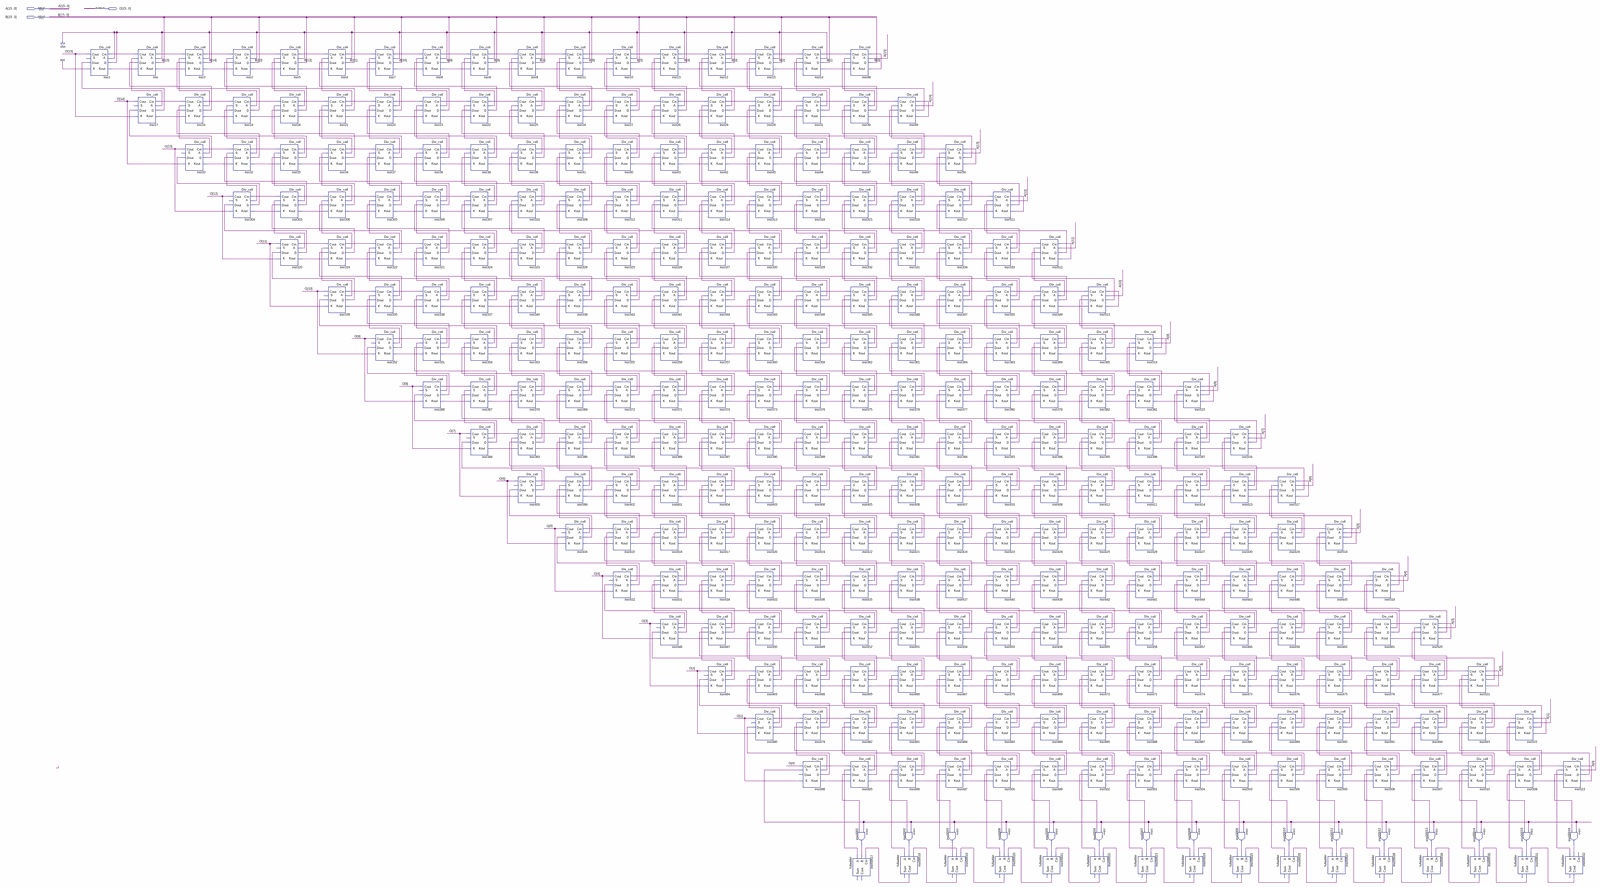
[diagram p0: schematic sheet, whole]
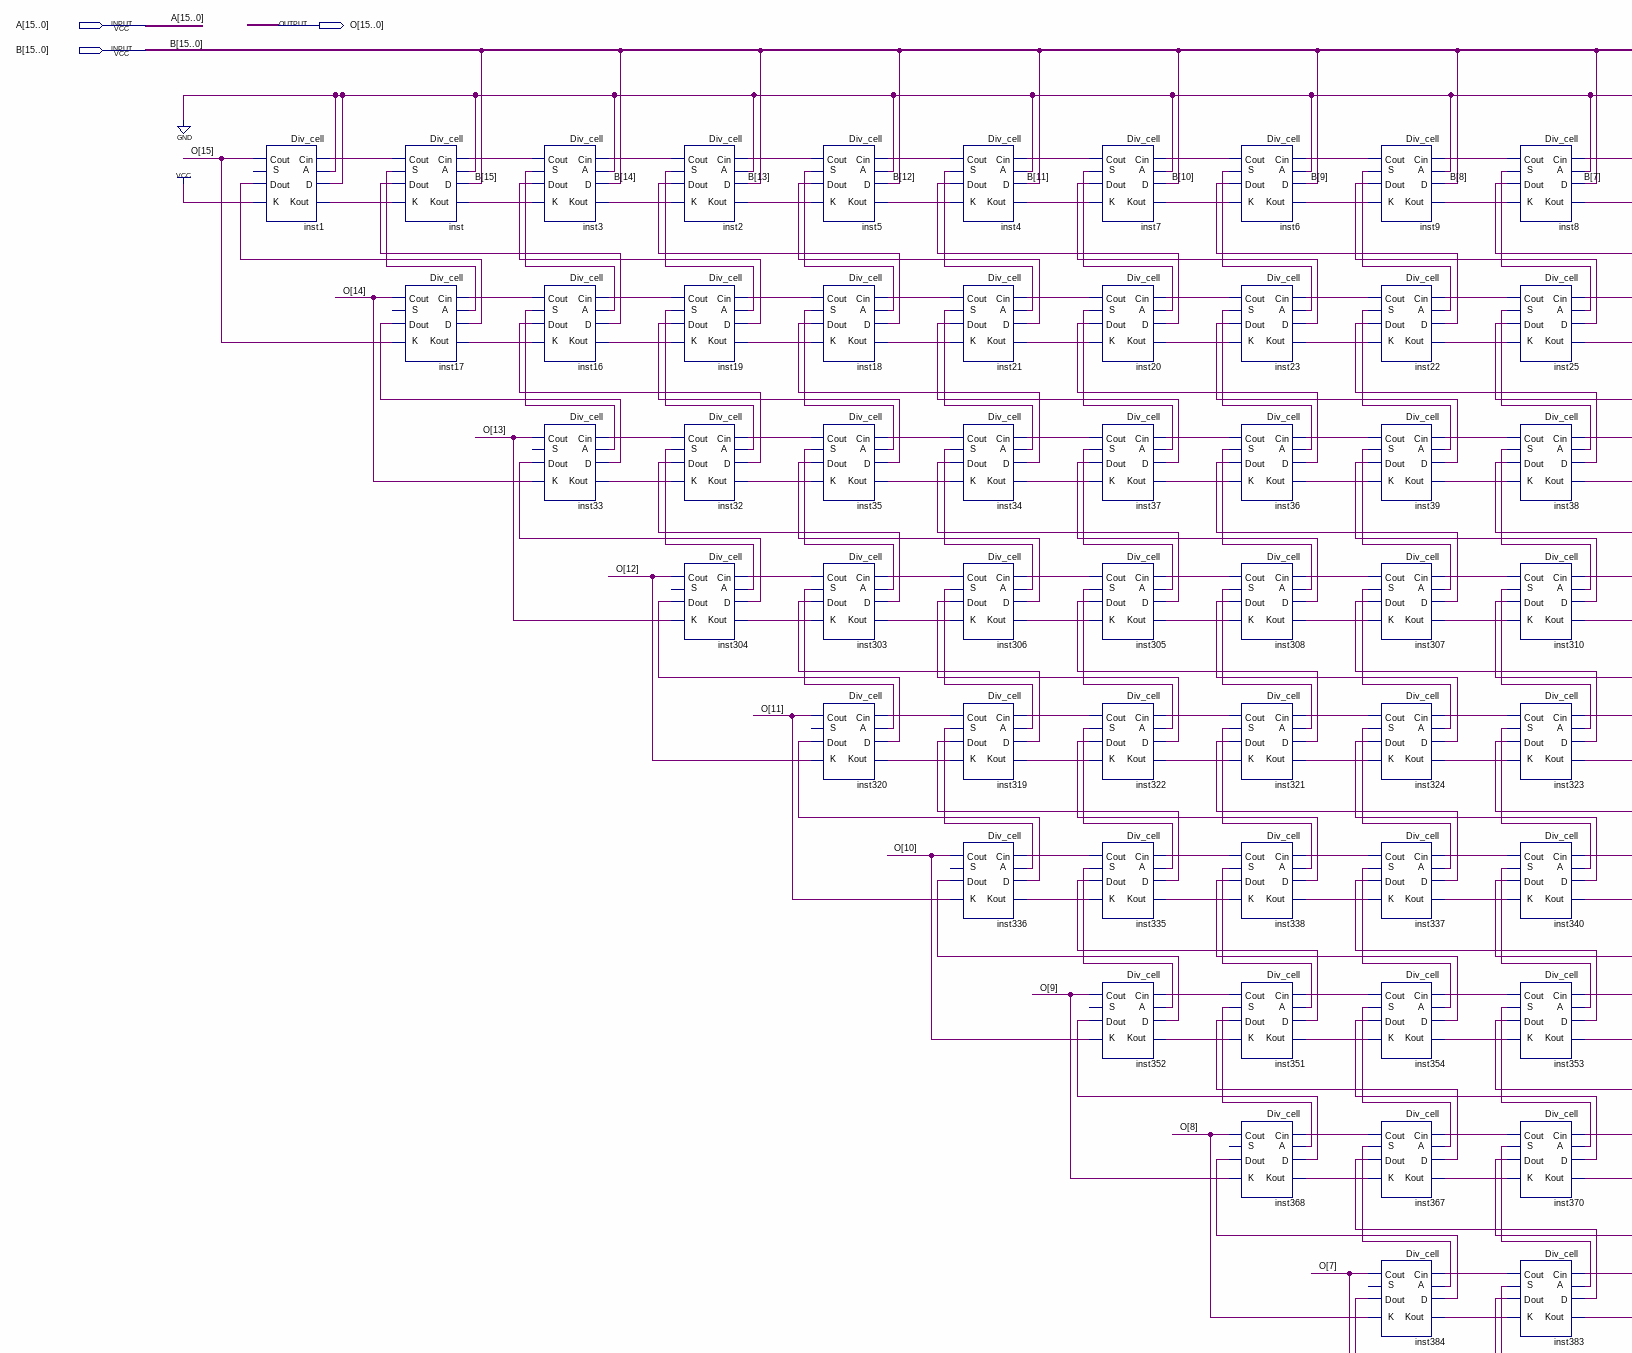
[diagram p1: schematic sheet, upper left part]
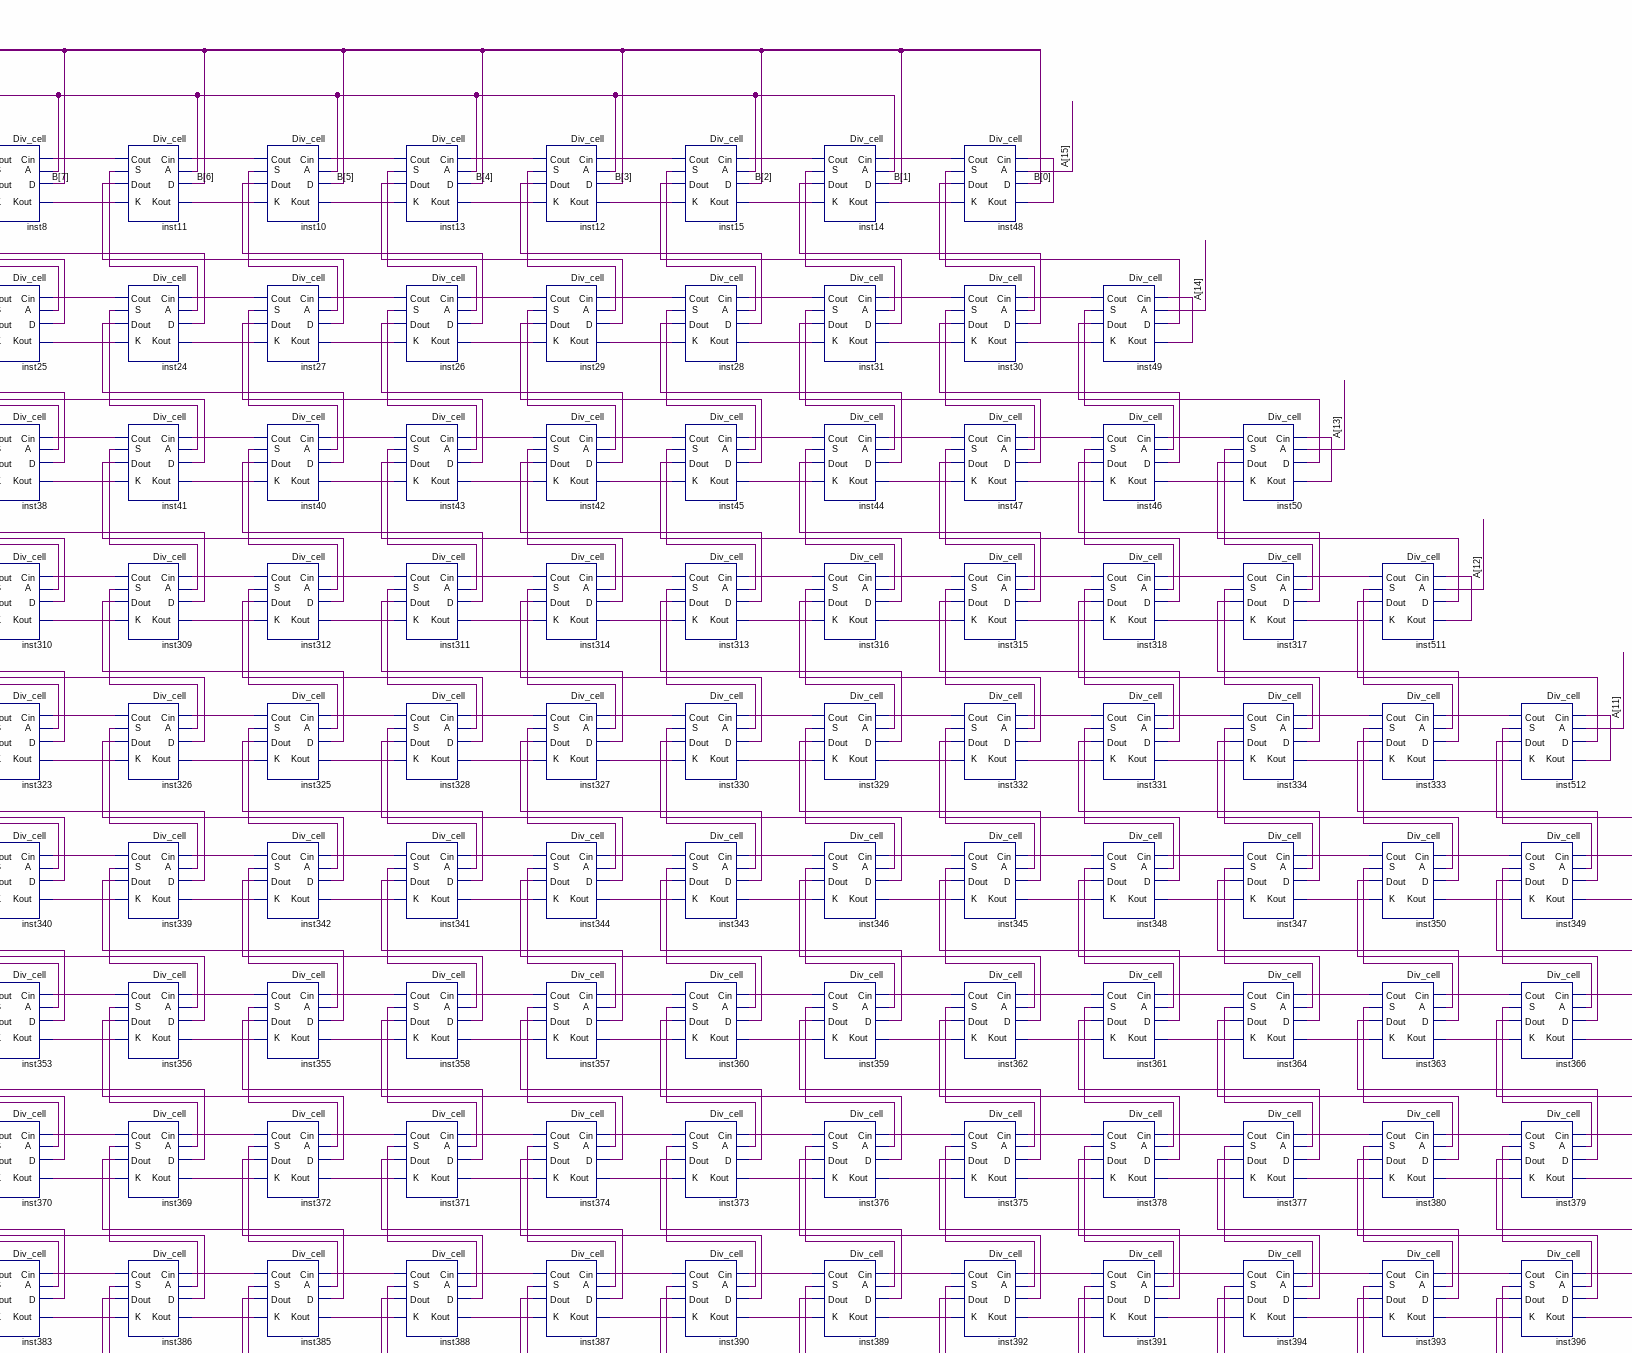
[diagram p2: schematic sheet, upper centre part]
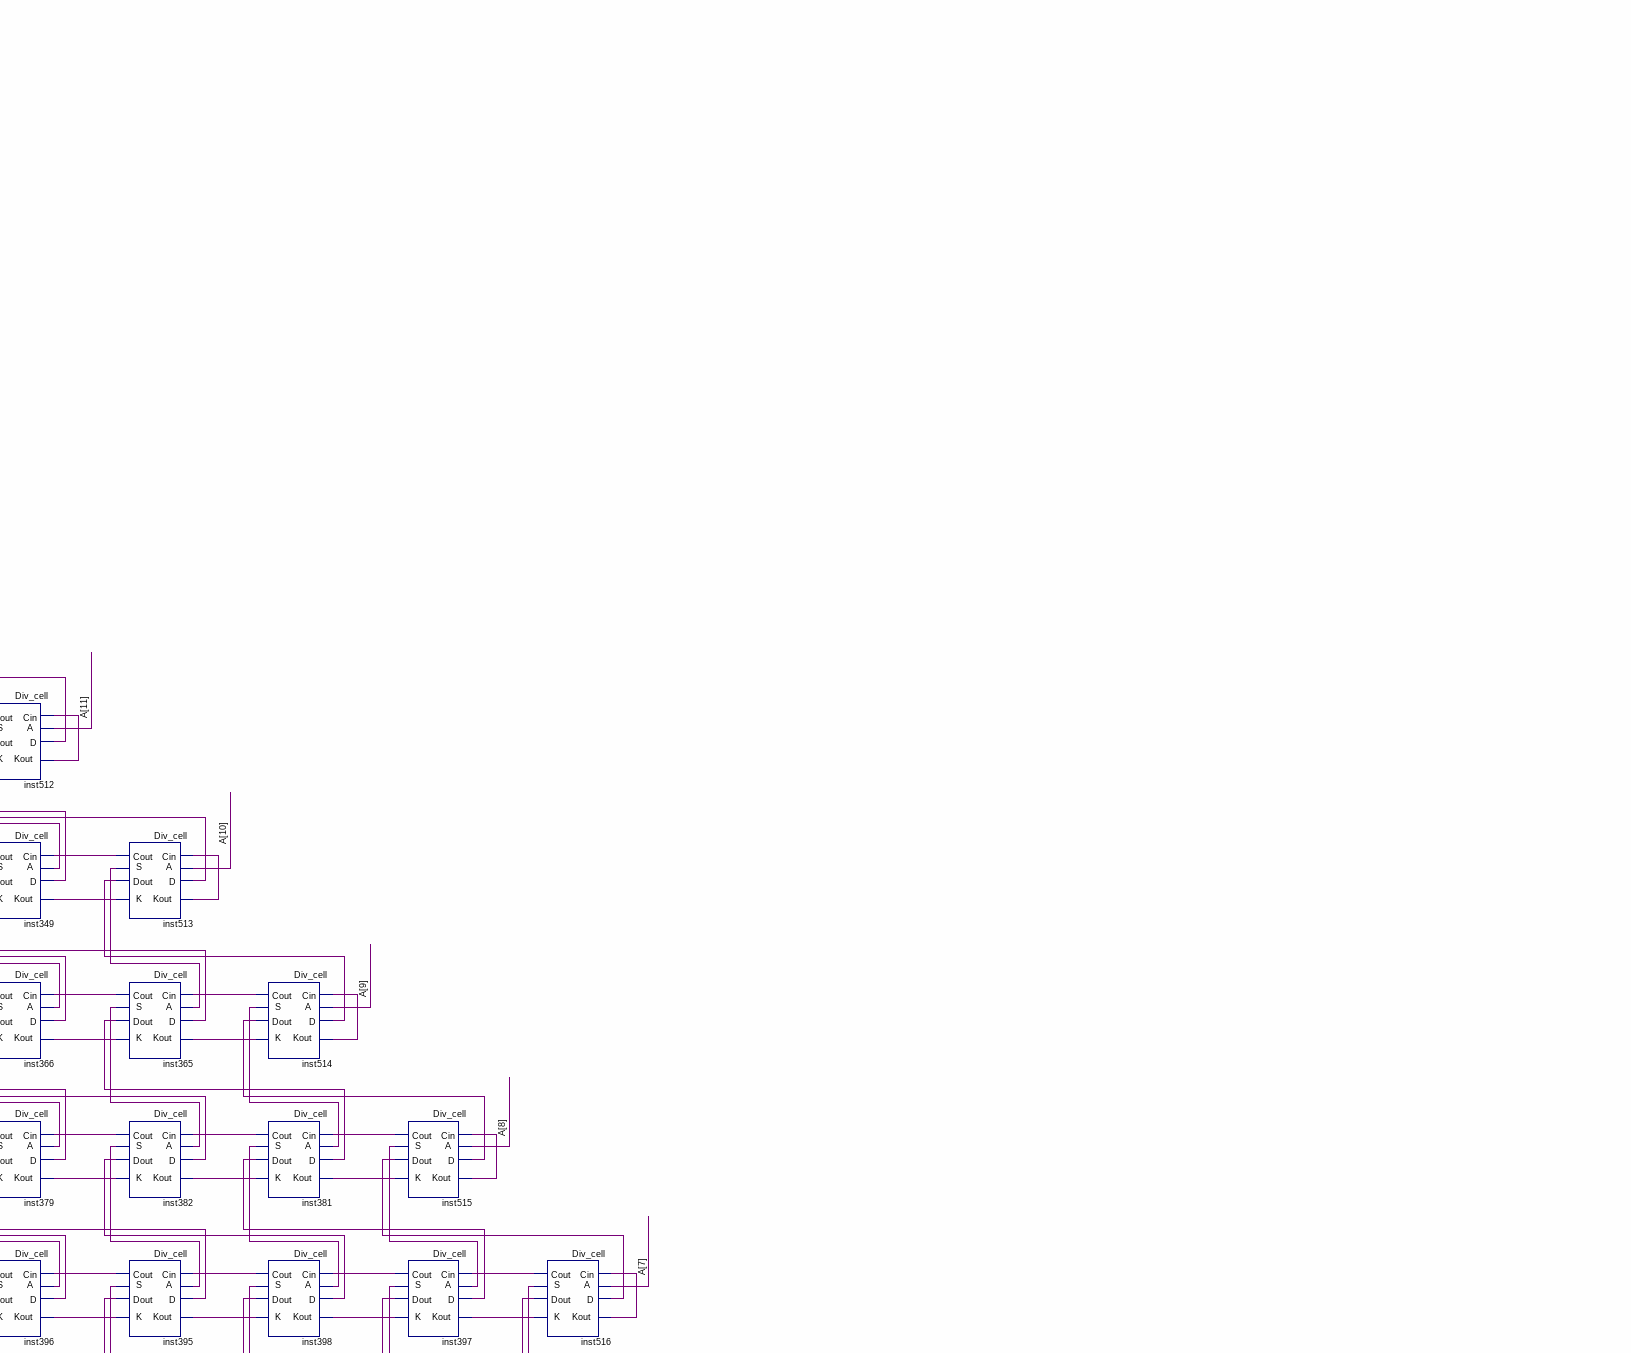
[diagram p3: schematic sheet, upper right part]
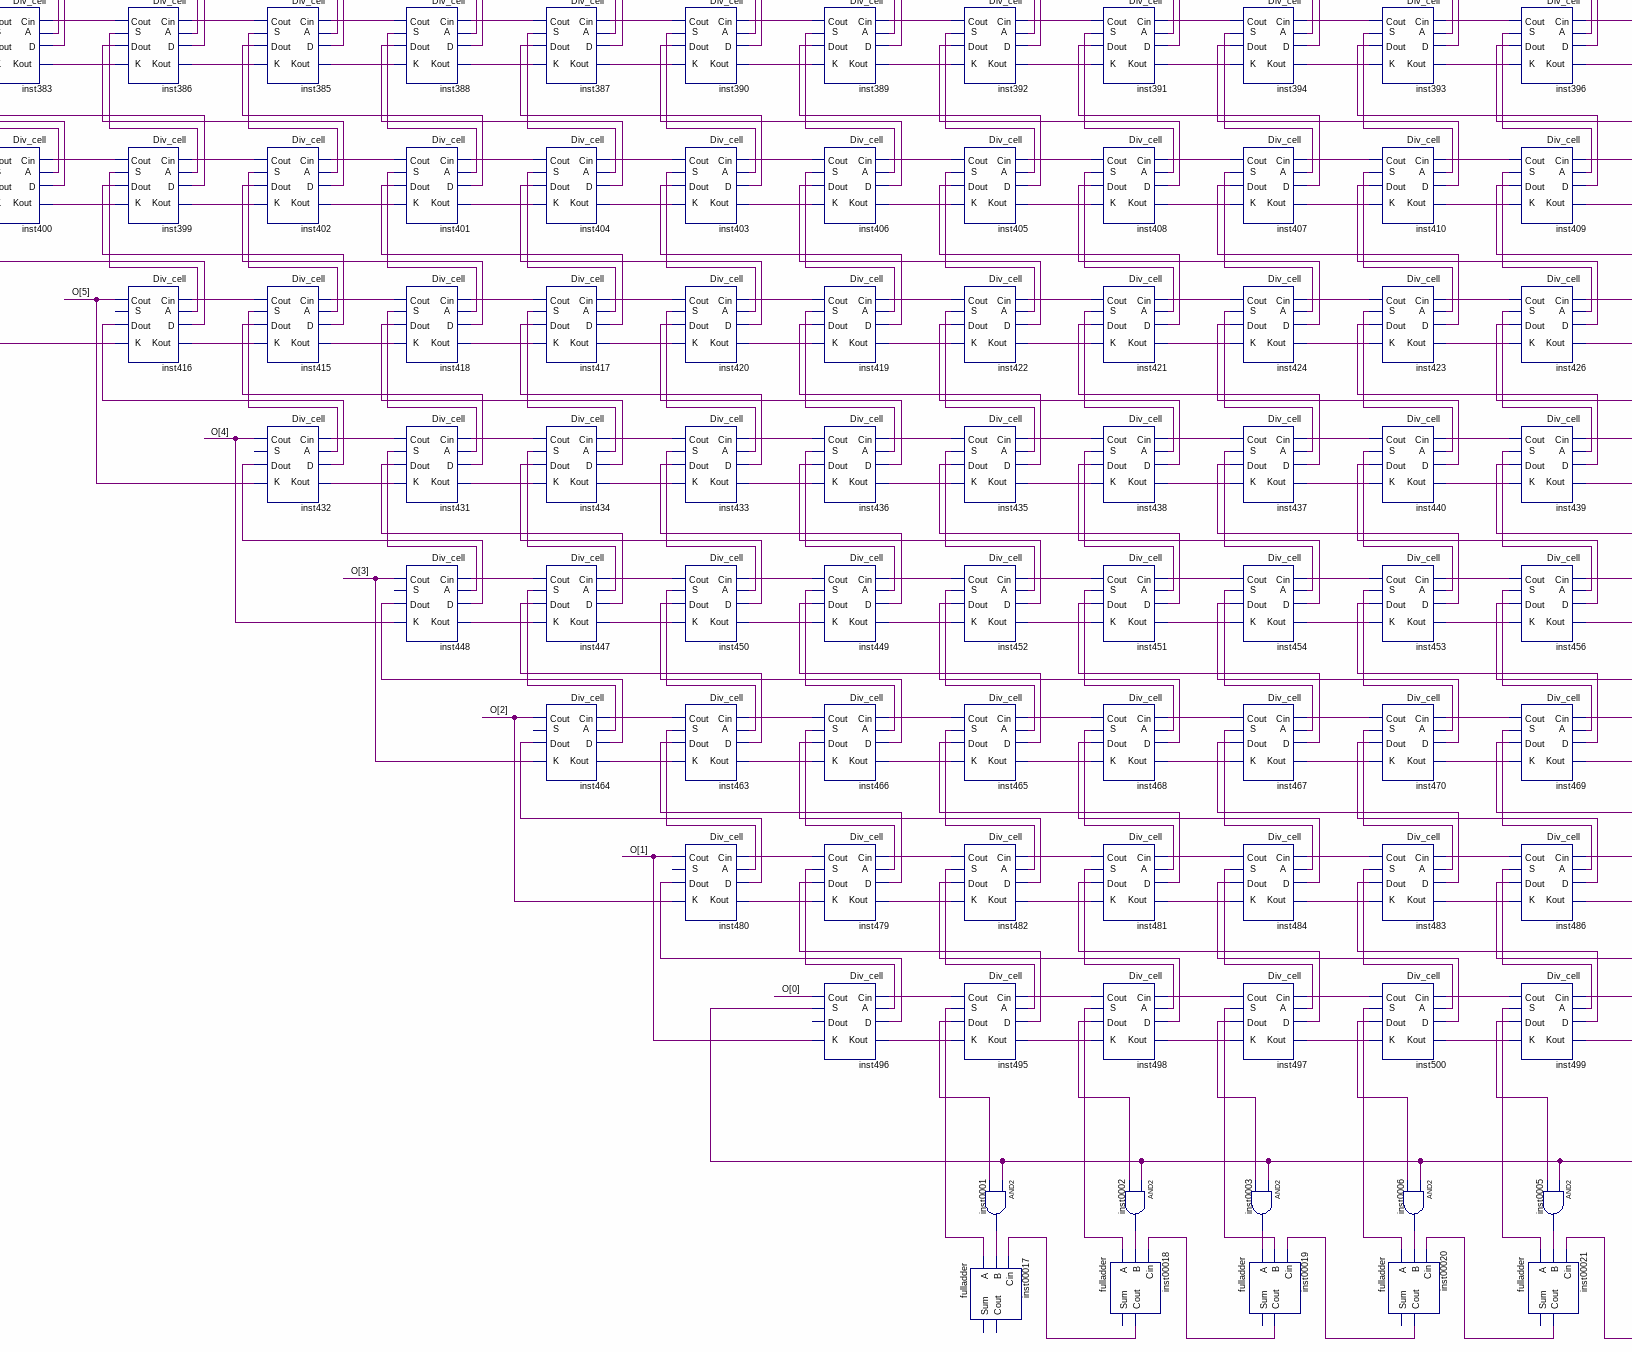
[diagram p4: schematic sheet, lower centre part]
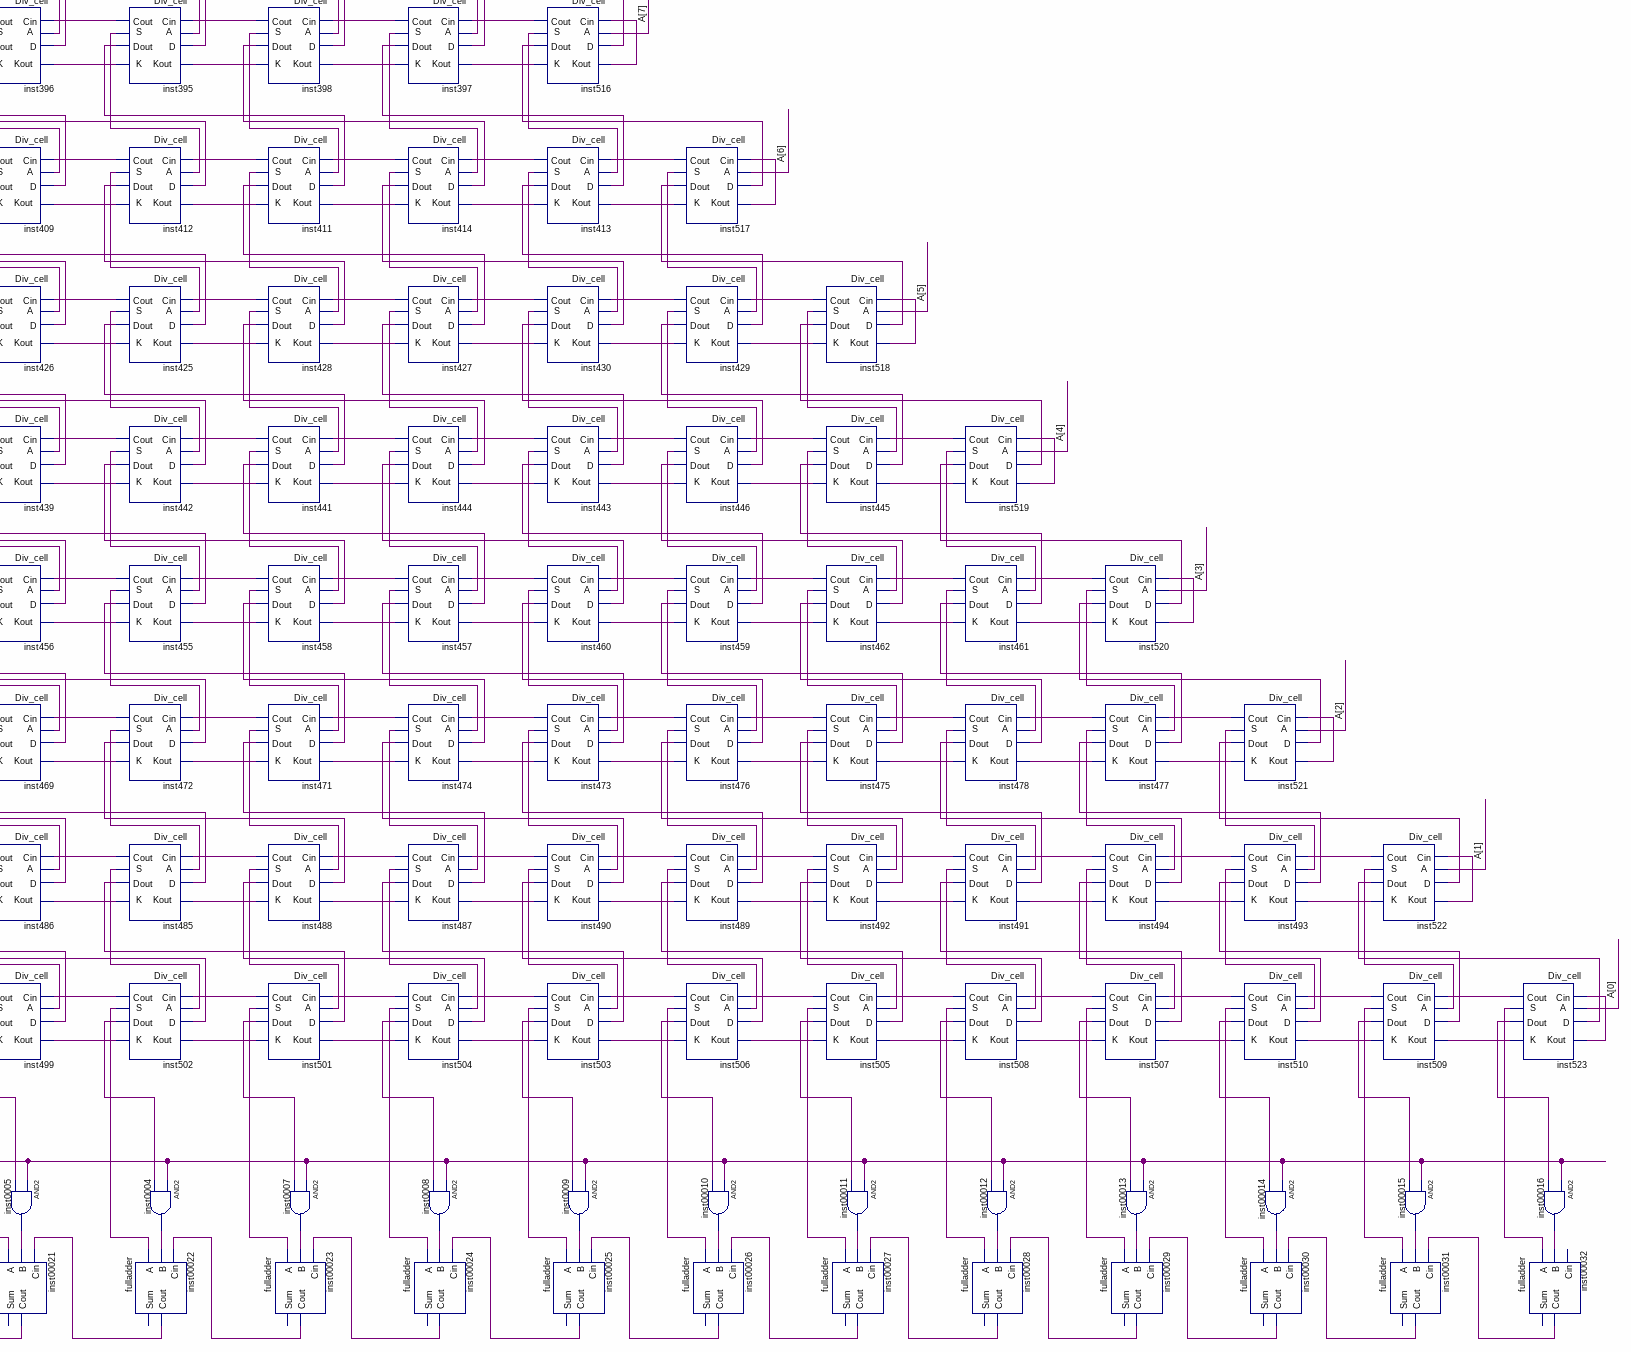
[diagram p5: schematic sheet, lower right part]
// Quartus schematic DividerBlock.bdf as structural Verilog: 304 symbols, 3 pins
module DividerBlock (
  input  [15:0] A,
  input  [15:0] B,
  output [15:0] O
);

  wire inst1_dout, inst1_kout, inst0001_out, inst2_cout, inst2_dout, inst2_kout, inst0002_out, inst2_s,
       inst3_cout, inst3_dout, inst3_kout, inst0003_out, inst3_s, inst4_cout, inst4_dout, inst4_kout,
       inst0004_out, inst4_s, inst5_cout, inst5_dout, inst5_kout, inst0005_out, inst5_s, inst6_cout,
       inst6_dout, inst6_kout, inst0006_out, inst6_s, inst7_cout, inst7_dout, inst7_kout, inst0007_out,
       inst7_s, inst8_cout, inst8_dout, inst8_kout, inst0008_out, inst8_s, inst9_cout, inst9_dout,
       inst9_kout, inst0009_out, inst9_s, inst10_cout, inst10_dout, inst10_kout, inst00010_out, inst10_s,
       inst11_cout, inst11_dout, inst11_kout, inst00011_out, inst11_s, inst12_cout, inst12_dout, inst12_kout,
       inst00012_out, inst12_s, inst13_cout, inst13_dout, inst13_kout, inst00013_out, inst13_s, inst14_cout,
       inst14_dout, inst14_kout, inst00014_out, inst14_s, inst15_cout, inst15_dout, inst15_kout,
       inst00015_out, inst15_s, inst16_cout, inst16_dout, inst16_kout, inst00016_out, inst16_s, inst17_dout,
       inst17_kout, inst18_cout, inst00018_cout, inst18_dout, inst18_kout, inst18_s, inst19_cout,
       inst00019_cout, inst19_dout, inst19_kout, inst19_s, inst20_cout, inst00020_cout, inst20_dout,
       inst20_kout, inst20_s, inst21_cout, inst00021_cout, inst21_dout, inst21_kout, inst21_s, inst22_cout,
       inst00022_cout, inst22_dout, inst22_kout, inst22_s, inst23_cout, inst00023_cout, inst23_dout,
       inst23_kout, inst23_s, inst24_cout, inst00024_cout, inst24_dout, inst24_kout, inst24_s, inst25_cout,
       inst00025_cout, inst25_dout, inst25_kout, inst25_s, inst26_cout, inst00026_cout, inst26_dout,
       inst26_kout, inst26_s, inst27_cout, inst00027_cout, inst27_dout, inst27_kout, inst27_s, inst28_cout,
       inst00028_cout, inst28_dout, inst28_kout, inst28_s, inst00029_cout, inst29_cout, inst29_dout,
       inst29_kout, inst29_s, inst30_cout, inst00030_cout, inst30_dout, inst30_kout, inst30_s, inst31_cout,
       inst00031_cout, inst31_dout, inst31_kout, inst31_s, inst32_cout, inst00032_cout, inst32_dout,
       inst32_kout, inst32_s, inst33_dout, inst33_kout, inst34_cout, inst34_dout, inst34_kout, inst34_s,
       inst35_cout, inst35_dout, inst35_kout, inst35_s, inst36_cout, inst36_dout, inst36_kout, inst36_s,
       inst37_cout, inst37_dout, inst37_kout, inst37_s, inst38_cout, inst38_dout, inst38_kout, inst38_s,
       inst39_cout, inst39_dout, inst39_kout, inst39_s, inst40_cout, inst40_dout, inst40_kout, inst40_s,
       inst41_cout, inst41_dout, inst41_kout, inst41_s, inst42_cout, inst42_dout, inst42_kout, inst42_s,
       inst43_cout, inst43_dout, inst43_kout, inst43_s, inst44_cout, inst44_dout, inst44_kout, inst44_s,
       inst45_cout, inst45_dout, inst45_kout, inst45_s, inst46_cout, inst46_dout, inst46_kout, inst46_s,
       inst47_cout, inst47_dout, inst47_kout, inst47_s, inst48_cout, inst48_dout, inst48_kout, inst48_s,
       inst49_cout, inst49_dout, inst49_kout, inst49_s, inst50_cout, inst50_dout, inst50_kout, inst50_s,
       inst303_cout, inst303_dout, inst303_kout, inst303_s, inst304_dout, inst304_kout, inst305_cout,
       inst305_dout, inst305_kout, inst305_s, inst306_cout, inst306_dout, inst306_kout, inst306_s,
       inst307_cout, inst307_dout, inst307_kout, inst307_s, inst308_cout, inst308_dout, inst308_kout,
       inst308_s, inst309_cout, inst309_dout, inst309_kout, inst309_s, inst310_cout, inst310_dout,
       inst310_kout, inst310_s, inst311_cout, inst311_dout, inst311_kout, inst311_s, inst312_cout,
       inst312_dout, inst312_kout, inst312_s, inst313_cout, inst313_dout, inst313_kout, inst313_s,
       inst314_cout, inst314_dout, inst314_kout, inst314_s, inst315_cout, inst315_dout, inst315_kout,
       inst315_s, inst316_cout, inst316_dout, inst316_kout, inst316_s, inst317_cout, inst317_dout,
       inst317_kout, inst317_s, inst318_cout, inst318_dout, inst318_kout, inst318_s, inst319_cout,
       inst319_dout, inst319_kout, inst319_s, inst320_dout, inst320_kout, inst321_cout, inst321_dout,
       inst321_kout, inst321_s, inst322_cout, inst322_dout, inst322_kout, inst322_s, inst323_cout,
       inst323_dout, inst323_kout, inst323_s, inst324_cout, inst324_dout, inst324_kout, inst324_s,
       inst325_cout, inst325_dout, inst325_kout, inst325_s, inst326_cout, inst326_dout, inst326_kout,
       inst326_s, inst327_cout, inst327_dout, inst327_kout, inst327_s, inst328_cout, inst328_dout,
       inst328_kout, inst328_s, inst329_cout, inst329_dout, inst329_kout, inst329_s, inst330_cout,
       inst330_dout, inst330_kout, inst330_s, inst331_cout, inst331_dout, inst331_kout, inst331_s,
       inst332_cout, inst332_dout, inst332_kout, inst332_s, inst333_cout, inst333_dout, inst333_kout,
       inst333_s, inst334_cout, inst334_dout, inst334_kout, inst334_s, inst335_cout, inst335_dout,
       inst335_kout, inst335_s, inst336_dout, inst336_kout, inst337_cout, inst337_dout, inst337_kout,
       inst337_s, inst338_cout, inst338_dout, inst338_kout, inst338_s, inst339_cout, inst339_dout,
       inst339_kout, inst339_s, inst340_cout, inst340_dout, inst340_kout, inst340_s, inst341_cout,
       inst341_dout, inst341_kout, inst341_s, inst342_cout, inst342_dout, inst342_kout, inst342_s,
       inst343_cout, inst343_dout, inst343_kout, inst343_s, inst344_cout, inst344_dout, inst344_kout,
       inst344_s, inst345_cout, inst345_dout, inst345_kout, inst345_s, inst346_cout, inst346_dout,
       inst346_kout, inst346_s, inst347_cout, inst347_dout, inst347_kout, inst347_s, inst348_cout,
       inst348_dout, inst348_kout, inst348_s, inst349_cout, inst349_dout, inst349_kout, inst349_s,
       inst350_cout, inst350_dout, inst350_kout, inst350_s, inst351_cout, inst351_dout, inst351_kout,
       inst351_s, inst352_dout, inst352_kout, inst353_cout, inst353_dout, inst353_kout, inst353_s,
       inst354_cout, inst354_dout, inst354_kout, inst354_s, inst355_cout, inst355_dout, inst355_kout,
       inst355_s, inst356_cout, inst356_dout, inst356_kout, inst356_s, inst357_cout, inst357_dout,
       inst357_kout, inst357_s, inst358_cout, inst358_dout, inst358_kout, inst358_s, inst359_cout,
       inst359_dout, inst359_kout, inst359_s, inst360_cout, inst360_dout, inst360_kout, inst360_s,
       inst361_cout, inst361_dout, inst361_kout, inst361_s, inst362_cout, inst362_dout, inst362_kout,
       inst362_s, inst363_cout, inst363_dout, inst363_kout, inst363_s, inst364_cout, inst364_dout,
       inst364_kout, inst364_s, inst365_cout, inst365_dout, inst365_kout, inst365_s, inst366_cout,
       inst366_dout, inst366_kout, inst366_s, inst367_cout, inst367_dout, inst367_kout, inst367_s,
       inst368_dout, inst368_kout, inst369_cout, inst369_dout, inst369_kout, inst369_s, inst370_cout,
       inst370_dout, inst370_kout, inst370_s, inst371_cout, inst371_dout, inst371_kout, inst371_s,
       inst372_cout, inst372_dout, inst372_kout, inst372_s, inst373_cout, inst373_dout, inst373_kout,
       inst373_s, inst374_cout, inst374_dout, inst374_kout, inst374_s, inst375_cout, inst375_dout,
       inst375_kout, inst375_s, inst376_cout, inst376_dout, inst376_kout, inst376_s, inst377_cout,
       inst377_dout, inst377_kout, inst377_s, inst378_cout, inst378_dout, inst378_kout, inst378_s,
       inst379_cout, inst379_dout, inst379_kout, inst379_s, inst380_cout, inst380_dout, inst380_kout,
       inst380_s, inst381_cout, inst381_dout, inst381_kout, inst381_s, inst382_cout, inst382_dout,
       inst382_kout, inst382_s, inst383_cout, inst383_dout, inst383_kout, inst383_s, inst384_dout,
       inst384_kout, inst385_cout, inst385_dout, inst385_kout, inst385_s, inst386_cout, inst386_dout,
       inst386_kout, inst386_s, inst387_cout, inst387_dout, inst387_kout, inst387_s, inst388_cout,
       inst388_dout, inst388_kout, inst388_s, inst389_cout, inst389_dout, inst389_kout, inst389_s,
       inst390_cout, inst390_dout, inst390_kout, inst390_s, inst391_cout, inst391_dout, inst391_kout,
       inst391_s, inst392_cout, inst392_dout, inst392_kout, inst392_s, inst393_cout, inst393_dout,
       inst393_kout, inst393_s, inst394_cout, inst394_dout, inst394_kout, inst394_s, inst395_cout,
       inst395_dout, inst395_kout, inst395_s, inst396_cout, inst396_dout, inst396_kout, inst396_s,
       inst397_cout, inst397_dout, inst397_kout, inst397_s, inst398_cout, inst398_dout, inst398_kout,
       inst398_s, inst399_cout, inst399_dout, inst399_kout, inst399_s, inst400_dout, inst400_kout,
       inst401_cout, inst401_dout, inst401_kout, inst401_s, inst402_cout, inst402_dout, inst402_kout,
       inst402_s, inst403_cout, inst403_dout, inst403_kout, inst403_s, inst404_cout, inst404_dout,
       inst404_kout, inst404_s, inst405_cout, inst405_dout, inst405_kout, inst405_s, inst406_cout,
       inst406_dout, inst406_kout, inst406_s, inst407_cout, inst407_dout, inst407_kout, inst407_s,
       inst408_cout, inst408_dout, inst408_kout, inst408_s, inst409_cout, inst409_dout, inst409_kout,
       inst409_s, inst410_cout, inst410_dout, inst410_kout, inst410_s, inst411_cout, inst411_dout,
       inst411_kout, inst411_s, inst412_cout, inst412_dout, inst412_kout, inst412_s, inst413_cout,
       inst413_dout, inst413_kout, inst413_s, inst414_cout, inst414_dout, inst414_kout, inst414_s,
       inst415_cout, inst415_dout, inst415_kout, inst415_s, inst416_dout, inst416_kout, inst417_cout,
       inst417_dout, inst417_kout, inst417_s, inst418_cout, inst418_dout, inst418_kout, inst418_s,
       inst419_cout, inst419_dout, inst419_kout, inst419_s, inst420_cout, inst420_dout, inst420_kout,
       inst420_s, inst421_cout, inst421_dout, inst421_kout, inst421_s, inst422_cout, inst422_dout,
       inst422_kout, inst422_s, inst423_cout, inst423_dout, inst423_kout, inst423_s, inst424_cout,
       inst424_dout, inst424_kout, inst424_s, inst425_cout, inst425_dout, inst425_kout, inst425_s,
       inst426_cout, inst426_dout, inst426_kout, inst426_s, inst427_cout, inst427_dout, inst427_kout,
       inst427_s, inst428_cout, inst428_dout, inst428_kout, inst428_s, inst429_cout, inst429_dout,
       inst429_kout, inst429_s, inst430_cout, inst430_dout, inst430_kout, inst430_s, inst431_cout,
       inst431_dout, inst431_kout, inst431_s, inst432_dout, inst432_kout, inst433_cout, inst433_dout,
       inst433_kout, inst433_s, inst434_cout, inst434_dout, inst434_kout, inst434_s, inst435_cout,
       inst435_dout, inst435_kout, inst435_s, inst436_cout, inst436_dout, inst436_kout, inst436_s,
       inst437_cout, inst437_dout, inst437_kout, inst437_s, inst438_cout, inst438_dout, inst438_kout,
       inst438_s, inst439_cout, inst439_dout, inst439_kout, inst439_s, inst440_cout, inst440_dout,
       inst440_kout, inst440_s, inst441_cout, inst441_dout, inst441_kout, inst441_s, inst442_cout,
       inst442_dout, inst442_kout, inst442_s, inst443_cout, inst443_dout, inst443_kout, inst443_s,
       inst444_cout, inst444_dout, inst444_kout, inst444_s, inst445_cout, inst445_dout, inst445_kout,
       inst445_s, inst446_cout, inst446_dout, inst446_kout, inst446_s, inst447_cout, inst447_dout,
       inst447_kout, inst447_s, inst448_dout, inst448_kout, inst449_cout, inst449_dout, inst449_kout,
       inst449_s, inst450_cout, inst450_dout, inst450_kout, inst450_s, inst451_cout, inst451_dout,
       inst451_kout, inst451_s, inst452_cout, inst452_dout, inst452_kout, inst452_s, inst453_cout,
       inst453_dout, inst453_kout, inst453_s, inst454_cout, inst454_dout, inst454_kout, inst454_s,
       inst455_cout, inst455_dout, inst455_kout, inst455_s, inst456_cout, inst456_dout, inst456_kout,
       inst456_s, inst457_cout, inst457_dout, inst457_kout, inst457_s, inst458_cout, inst458_dout,
       inst458_kout, inst458_s, inst459_cout, inst459_dout, inst459_kout, inst459_s, inst460_cout,
       inst460_dout, inst460_kout, inst460_s, inst461_cout, inst461_dout, inst461_kout, inst461_s,
       inst462_cout, inst462_dout, inst462_kout, inst462_s, inst463_cout, inst463_dout, inst463_kout,
       inst463_s, inst464_dout, inst464_kout, inst465_cout, inst465_dout, inst465_kout, inst465_s,
       inst466_cout, inst466_dout, inst466_kout, inst466_s, inst467_cout, inst467_dout, inst467_kout,
       inst467_s, inst468_cout, inst468_dout, inst468_kout, inst468_s, inst469_cout, inst469_dout,
       inst469_kout, inst469_s, inst470_cout, inst470_dout, inst470_kout, inst470_s, inst471_cout,
       inst471_dout, inst471_kout, inst471_s, inst472_cout, inst472_dout, inst472_kout, inst472_s,
       inst473_cout, inst473_dout, inst473_kout, inst473_s, inst474_cout, inst474_dout, inst474_kout,
       inst474_s, inst475_cout, inst475_dout, inst475_kout, inst475_s, inst476_cout, inst476_dout,
       inst476_kout, inst476_s, inst477_cout, inst477_dout, inst477_kout, inst477_s, inst478_cout,
       inst478_dout, inst478_kout, inst478_s, inst479_cout, inst479_dout, inst479_kout, inst479_s,
       inst480_dout, inst480_kout, inst481_cout, inst481_dout, inst481_kout, inst481_s, inst482_cout,
       inst482_dout, inst482_kout, inst482_s, inst483_cout, inst483_dout, inst483_kout, inst483_s,
       inst484_cout, inst484_dout, inst484_kout, inst484_s, inst485_cout, inst485_dout, inst485_kout,
       inst485_s, inst486_cout, inst486_dout, inst486_kout, inst486_s, inst487_cout, inst487_dout,
       inst487_kout, inst487_s, inst488_cout, inst488_dout, inst488_kout, inst488_s, inst489_cout,
       inst489_dout, inst489_kout, inst489_s, inst490_cout, inst490_dout, inst490_kout, inst490_s,
       inst491_cout, inst491_dout, inst491_kout, inst491_s, inst492_cout, inst492_dout, inst492_kout,
       inst492_s, inst493_cout, inst493_dout, inst493_kout, inst493_s, inst494_cout, inst494_dout,
       inst494_kout, inst494_s, inst495_cout, inst495_dout, inst495_kout, inst495_s, inst496_kout, inst496_s,
       inst497_cout, inst497_dout, inst497_kout, inst497_s, inst498_cout, inst498_dout, inst498_kout,
       inst498_s, inst499_cout, inst499_dout, inst499_kout, inst499_s, inst500_cout, inst500_dout,
       inst500_kout, inst500_s, inst501_cout, inst501_dout, inst501_kout, inst501_s, inst502_cout,
       inst502_dout, inst502_kout, inst502_s, inst503_cout, inst503_dout, inst503_kout, inst503_s,
       inst504_cout, inst504_dout, inst504_kout, inst504_s, inst505_cout, inst505_dout, inst505_kout,
       inst505_s, inst506_cout, inst506_dout, inst506_kout, inst506_s, inst507_cout, inst507_dout,
       inst507_kout, inst507_s, inst508_cout, inst508_dout, inst508_kout, inst508_s, inst509_cout,
       inst509_dout, inst509_kout, inst509_s, inst510_cout, inst510_dout, inst510_kout, inst510_s,
       inst511_cout, inst511_dout, inst511_kout, inst511_s, inst512_cout, inst512_dout, inst512_kout,
       inst512_s, inst513_cout, inst513_dout, inst513_kout, inst513_s, inst514_cout, inst514_dout,
       inst514_kout, inst514_s, inst515_cout, inst515_dout, inst515_kout, inst515_s, inst516_cout,
       inst516_dout, inst516_kout, inst516_s, inst517_cout, inst517_dout, inst517_kout, inst517_s,
       inst518_cout, inst518_dout, inst518_kout, inst518_s, inst519_cout, inst519_dout, inst519_kout,
       inst519_s, inst520_cout, inst520_dout, inst520_kout, inst520_s, inst521_cout, inst521_dout,
       inst521_kout, inst521_s, inst522_cout, inst522_dout, inst522_kout, inst522_s, inst523_cout,
       inst523_dout, inst523_kout, inst523_s, inst_cout, inst_dout, inst_kout, inst_s;

  Div_cell inst1 (
    .Cin(inst_cout), .A(1'b0), .D(1'b0), .K(1'b1), .Cout(O[15]), .Dout(inst1_dout), .Kout(inst1_kout));  // open: S
  Div_cell inst (
    .Cin(inst3_cout), .A(1'b0), .D(B[15]), .K(inst1_kout), .Cout(inst_cout), .S(inst_s), .Dout(inst_dout),
    .Kout(inst_kout));
  Div_cell inst17 (
    .Cin(inst16_cout), .A(inst_s), .D(inst1_dout), .K(O[15]), .Cout(O[14]), .Dout(inst17_dout),
    .Kout(inst17_kout));  // open: S
  Div_cell inst3 (
    .Cin(inst2_cout), .A(1'b0), .D(B[14]), .K(inst_kout), .Cout(inst3_cout), .S(inst3_s), .Dout(inst3_dout),
    .Kout(inst3_kout));
  Div_cell inst16 (
    .Cin(inst19_cout), .A(inst3_s), .D(inst_dout), .K(inst17_kout), .Cout(inst16_cout), .S(inst16_s),
    .Dout(inst16_dout), .Kout(inst16_kout));
  Div_cell inst33 (
    .Cin(inst32_cout), .A(inst16_s), .D(inst17_dout), .K(O[14]), .Cout(O[13]), .Dout(inst33_dout),
    .Kout(inst33_kout));  // open: S
  Div_cell inst2 (
    .Cin(inst5_cout), .A(1'b0), .D(B[13]), .K(inst3_kout), .Cout(inst2_cout), .S(inst2_s), .Dout(inst2_dout),
    .Kout(inst2_kout));
  Div_cell inst19 (
    .Cin(inst18_cout), .A(inst2_s), .D(inst3_dout), .K(inst16_kout), .Cout(inst19_cout), .S(inst19_s),
    .Dout(inst19_dout), .Kout(inst19_kout));
  Div_cell inst32 (
    .Cin(inst35_cout), .A(inst19_s), .D(inst16_dout), .K(inst33_kout), .Cout(inst32_cout), .S(inst32_s),
    .Dout(inst32_dout), .Kout(inst32_kout));
  Div_cell inst304 (
    .Cin(inst303_cout), .A(inst32_s), .D(inst33_dout), .K(O[13]), .Cout(O[12]), .Dout(inst304_dout),
    .Kout(inst304_kout));  // open: S
  Div_cell inst5 (
    .Cin(inst4_cout), .A(1'b0), .D(B[12]), .K(inst2_kout), .Cout(inst5_cout), .S(inst5_s), .Dout(inst5_dout),
    .Kout(inst5_kout));
  Div_cell inst18 (
    .Cin(inst21_cout), .A(inst5_s), .D(inst2_dout), .K(inst19_kout), .Cout(inst18_cout), .S(inst18_s),
    .Dout(inst18_dout), .Kout(inst18_kout));
  Div_cell inst35 (
    .Cin(inst34_cout), .A(inst18_s), .D(inst19_dout), .K(inst32_kout), .Cout(inst35_cout), .S(inst35_s),
    .Dout(inst35_dout), .Kout(inst35_kout));
  Div_cell inst303 (
    .Cin(inst306_cout), .A(inst35_s), .D(inst32_dout), .K(inst304_kout), .Cout(inst303_cout), .S(inst303_s),
    .Dout(inst303_dout), .Kout(inst303_kout));
  Div_cell inst320 (
    .Cin(inst319_cout), .A(inst303_s), .D(inst304_dout), .K(O[12]), .Cout(O[11]), .Dout(inst320_dout),
    .Kout(inst320_kout));  // open: S
  Div_cell inst4 (
    .Cin(inst7_cout), .A(1'b0), .D(B[11]), .K(inst5_kout), .Cout(inst4_cout), .S(inst4_s), .Dout(inst4_dout),
    .Kout(inst4_kout));
  Div_cell inst21 (
    .Cin(inst20_cout), .A(inst4_s), .D(inst5_dout), .K(inst18_kout), .Cout(inst21_cout), .S(inst21_s),
    .Dout(inst21_dout), .Kout(inst21_kout));
  Div_cell inst34 (
    .Cin(inst37_cout), .A(inst21_s), .D(inst18_dout), .K(inst35_kout), .Cout(inst34_cout), .S(inst34_s),
    .Dout(inst34_dout), .Kout(inst34_kout));
  Div_cell inst306 (
    .Cin(inst305_cout), .A(inst34_s), .D(inst35_dout), .K(inst303_kout), .Cout(inst306_cout), .S(inst306_s),
    .Dout(inst306_dout), .Kout(inst306_kout));
  Div_cell inst319 (
    .Cin(inst322_cout), .A(inst306_s), .D(inst303_dout), .K(inst320_kout), .Cout(inst319_cout),
    .S(inst319_s), .Dout(inst319_dout), .Kout(inst319_kout));
  Div_cell inst336 (
    .Cin(inst335_cout), .A(inst319_s), .D(inst320_dout), .K(O[11]), .Cout(O[10]), .Dout(inst336_dout),
    .Kout(inst336_kout));  // open: S
  Div_cell inst7 (
    .Cin(inst6_cout), .A(1'b0), .D(B[10]), .K(inst4_kout), .Cout(inst7_cout), .S(inst7_s), .Dout(inst7_dout),
    .Kout(inst7_kout));
  Div_cell inst20 (
    .Cin(inst23_cout), .A(inst7_s), .D(inst4_dout), .K(inst21_kout), .Cout(inst20_cout), .S(inst20_s),
    .Dout(inst20_dout), .Kout(inst20_kout));
  Div_cell inst37 (
    .Cin(inst36_cout), .A(inst20_s), .D(inst21_dout), .K(inst34_kout), .Cout(inst37_cout), .S(inst37_s),
    .Dout(inst37_dout), .Kout(inst37_kout));
  Div_cell inst305 (
    .Cin(inst308_cout), .A(inst37_s), .D(inst34_dout), .K(inst306_kout), .Cout(inst305_cout), .S(inst305_s),
    .Dout(inst305_dout), .Kout(inst305_kout));
  Div_cell inst322 (
    .Cin(inst321_cout), .A(inst305_s), .D(inst306_dout), .K(inst319_kout), .Cout(inst322_cout),
    .S(inst322_s), .Dout(inst322_dout), .Kout(inst322_kout));
  Div_cell inst335 (
    .Cin(inst338_cout), .A(inst322_s), .D(inst319_dout), .K(inst336_kout), .Cout(inst335_cout),
    .S(inst335_s), .Dout(inst335_dout), .Kout(inst335_kout));
  Div_cell inst352 (
    .Cin(inst351_cout), .A(inst335_s), .D(inst336_dout), .K(O[10]), .Cout(O[9]), .Dout(inst352_dout),
    .Kout(inst352_kout));  // open: S
  Div_cell inst6 (
    .Cin(inst9_cout), .A(1'b0), .D(B[9]), .K(inst7_kout), .Cout(inst6_cout), .S(inst6_s), .Dout(inst6_dout),
    .Kout(inst6_kout));
  Div_cell inst23 (
    .Cin(inst22_cout), .A(inst6_s), .D(inst7_dout), .K(inst20_kout), .Cout(inst23_cout), .S(inst23_s),
    .Dout(inst23_dout), .Kout(inst23_kout));
  Div_cell inst36 (
    .Cin(inst39_cout), .A(inst23_s), .D(inst20_dout), .K(inst37_kout), .Cout(inst36_cout), .S(inst36_s),
    .Dout(inst36_dout), .Kout(inst36_kout));
  Div_cell inst308 (
    .Cin(inst307_cout), .A(inst36_s), .D(inst37_dout), .K(inst305_kout), .Cout(inst308_cout), .S(inst308_s),
    .Dout(inst308_dout), .Kout(inst308_kout));
  Div_cell inst321 (
    .Cin(inst324_cout), .A(inst308_s), .D(inst305_dout), .K(inst322_kout), .Cout(inst321_cout),
    .S(inst321_s), .Dout(inst321_dout), .Kout(inst321_kout));
  Div_cell inst338 (
    .Cin(inst337_cout), .A(inst321_s), .D(inst322_dout), .K(inst335_kout), .Cout(inst338_cout),
    .S(inst338_s), .Dout(inst338_dout), .Kout(inst338_kout));
  Div_cell inst351 (
    .Cin(inst354_cout), .A(inst338_s), .D(inst335_dout), .K(inst352_kout), .Cout(inst351_cout),
    .S(inst351_s), .Dout(inst351_dout), .Kout(inst351_kout));
  Div_cell inst368 (
    .Cin(inst367_cout), .A(inst351_s), .D(inst352_dout), .K(O[9]), .Cout(O[8]), .Dout(inst368_dout),
    .Kout(inst368_kout));  // open: S
  Div_cell inst9 (
    .Cin(inst8_cout), .A(1'b0), .D(B[8]), .K(inst6_kout), .Cout(inst9_cout), .S(inst9_s), .Dout(inst9_dout),
    .Kout(inst9_kout));
  Div_cell inst22 (
    .Cin(inst25_cout), .A(inst9_s), .D(inst6_dout), .K(inst23_kout), .Cout(inst22_cout), .S(inst22_s),
    .Dout(inst22_dout), .Kout(inst22_kout));
  Div_cell inst39 (
    .Cin(inst38_cout), .A(inst22_s), .D(inst23_dout), .K(inst36_kout), .Cout(inst39_cout), .S(inst39_s),
    .Dout(inst39_dout), .Kout(inst39_kout));
  Div_cell inst307 (
    .Cin(inst310_cout), .A(inst39_s), .D(inst36_dout), .K(inst308_kout), .Cout(inst307_cout), .S(inst307_s),
    .Dout(inst307_dout), .Kout(inst307_kout));
  Div_cell inst324 (
    .Cin(inst323_cout), .A(inst307_s), .D(inst308_dout), .K(inst321_kout), .Cout(inst324_cout),
    .S(inst324_s), .Dout(inst324_dout), .Kout(inst324_kout));
  Div_cell inst337 (
    .Cin(inst340_cout), .A(inst324_s), .D(inst321_dout), .K(inst338_kout), .Cout(inst337_cout),
    .S(inst337_s), .Dout(inst337_dout), .Kout(inst337_kout));
  Div_cell inst354 (
    .Cin(inst353_cout), .A(inst337_s), .D(inst338_dout), .K(inst351_kout), .Cout(inst354_cout),
    .S(inst354_s), .Dout(inst354_dout), .Kout(inst354_kout));
  Div_cell inst367 (
    .Cin(inst370_cout), .A(inst354_s), .D(inst351_dout), .K(inst368_kout), .Cout(inst367_cout),
    .S(inst367_s), .Dout(inst367_dout), .Kout(inst367_kout));
  Div_cell inst384 (
    .Cin(inst383_cout), .A(inst367_s), .D(inst368_dout), .K(O[8]), .Cout(O[7]), .Dout(inst384_dout),
    .Kout(inst384_kout));  // open: S
  Div_cell inst8 (
    .Cin(inst11_cout), .A(1'b0), .D(B[7]), .K(inst9_kout), .Cout(inst8_cout), .S(inst8_s), .Dout(inst8_dout),
    .Kout(inst8_kout));
  Div_cell inst25 (
    .Cin(inst24_cout), .A(inst8_s), .D(inst9_dout), .K(inst22_kout), .Cout(inst25_cout), .S(inst25_s),
    .Dout(inst25_dout), .Kout(inst25_kout));
  Div_cell inst38 (
    .Cin(inst41_cout), .A(inst25_s), .D(inst22_dout), .K(inst39_kout), .Cout(inst38_cout), .S(inst38_s),
    .Dout(inst38_dout), .Kout(inst38_kout));
  Div_cell inst310 (
    .Cin(inst309_cout), .A(inst38_s), .D(inst39_dout), .K(inst307_kout), .Cout(inst310_cout), .S(inst310_s),
    .Dout(inst310_dout), .Kout(inst310_kout));
  Div_cell inst323 (
    .Cin(inst326_cout), .A(inst310_s), .D(inst307_dout), .K(inst324_kout), .Cout(inst323_cout),
    .S(inst323_s), .Dout(inst323_dout), .Kout(inst323_kout));
  Div_cell inst340 (
    .Cin(inst339_cout), .A(inst323_s), .D(inst324_dout), .K(inst337_kout), .Cout(inst340_cout),
    .S(inst340_s), .Dout(inst340_dout), .Kout(inst340_kout));
  Div_cell inst353 (
    .Cin(inst356_cout), .A(inst340_s), .D(inst337_dout), .K(inst354_kout), .Cout(inst353_cout),
    .S(inst353_s), .Dout(inst353_dout), .Kout(inst353_kout));
  Div_cell inst370 (
    .Cin(inst369_cout), .A(inst353_s), .D(inst354_dout), .K(inst367_kout), .Cout(inst370_cout),
    .S(inst370_s), .Dout(inst370_dout), .Kout(inst370_kout));
  Div_cell inst383 (
    .Cin(inst386_cout), .A(inst370_s), .D(inst367_dout), .K(inst384_kout), .Cout(inst383_cout),
    .S(inst383_s), .Dout(inst383_dout), .Kout(inst383_kout));
  Div_cell inst400 (
    .Cin(inst399_cout), .A(inst383_s), .D(inst384_dout), .K(O[7]), .Cout(O[6]), .Dout(inst400_dout),
    .Kout(inst400_kout));  // open: S
  Div_cell inst11 (
    .Cin(inst10_cout), .A(1'b0), .D(B[6]), .K(inst8_kout), .Cout(inst11_cout), .S(inst11_s),
    .Dout(inst11_dout), .Kout(inst11_kout));
  Div_cell inst24 (
    .Cin(inst27_cout), .A(inst11_s), .D(inst8_dout), .K(inst25_kout), .Cout(inst24_cout), .S(inst24_s),
    .Dout(inst24_dout), .Kout(inst24_kout));
  Div_cell inst41 (
    .Cin(inst40_cout), .A(inst24_s), .D(inst25_dout), .K(inst38_kout), .Cout(inst41_cout), .S(inst41_s),
    .Dout(inst41_dout), .Kout(inst41_kout));
  Div_cell inst309 (
    .Cin(inst312_cout), .A(inst41_s), .D(inst38_dout), .K(inst310_kout), .Cout(inst309_cout), .S(inst309_s),
    .Dout(inst309_dout), .Kout(inst309_kout));
  Div_cell inst326 (
    .Cin(inst325_cout), .A(inst309_s), .D(inst310_dout), .K(inst323_kout), .Cout(inst326_cout),
    .S(inst326_s), .Dout(inst326_dout), .Kout(inst326_kout));
  Div_cell inst339 (
    .Cin(inst342_cout), .A(inst326_s), .D(inst323_dout), .K(inst340_kout), .Cout(inst339_cout),
    .S(inst339_s), .Dout(inst339_dout), .Kout(inst339_kout));
  Div_cell inst356 (
    .Cin(inst355_cout), .A(inst339_s), .D(inst340_dout), .K(inst353_kout), .Cout(inst356_cout),
    .S(inst356_s), .Dout(inst356_dout), .Kout(inst356_kout));
  Div_cell inst369 (
    .Cin(inst372_cout), .A(inst356_s), .D(inst353_dout), .K(inst370_kout), .Cout(inst369_cout),
    .S(inst369_s), .Dout(inst369_dout), .Kout(inst369_kout));
  Div_cell inst386 (
    .Cin(inst385_cout), .A(inst369_s), .D(inst370_dout), .K(inst383_kout), .Cout(inst386_cout),
    .S(inst386_s), .Dout(inst386_dout), .Kout(inst386_kout));
  Div_cell inst399 (
    .Cin(inst402_cout), .A(inst386_s), .D(inst383_dout), .K(inst400_kout), .Cout(inst399_cout),
    .S(inst399_s), .Dout(inst399_dout), .Kout(inst399_kout));
  Div_cell inst416 (
    .Cin(inst415_cout), .A(inst399_s), .D(inst400_dout), .K(O[6]), .Cout(O[5]), .Dout(inst416_dout),
    .Kout(inst416_kout));  // open: S
  Div_cell inst10 (
    .Cin(inst13_cout), .A(1'b0), .D(B[5]), .K(inst11_kout), .Cout(inst10_cout), .S(inst10_s),
    .Dout(inst10_dout), .Kout(inst10_kout));
  Div_cell inst27 (
    .Cin(inst26_cout), .A(inst10_s), .D(inst11_dout), .K(inst24_kout), .Cout(inst27_cout), .S(inst27_s),
    .Dout(inst27_dout), .Kout(inst27_kout));
  Div_cell inst40 (
    .Cin(inst43_cout), .A(inst27_s), .D(inst24_dout), .K(inst41_kout), .Cout(inst40_cout), .S(inst40_s),
    .Dout(inst40_dout), .Kout(inst40_kout));
  Div_cell inst312 (
    .Cin(inst311_cout), .A(inst40_s), .D(inst41_dout), .K(inst309_kout), .Cout(inst312_cout), .S(inst312_s),
    .Dout(inst312_dout), .Kout(inst312_kout));
  Div_cell inst325 (
    .Cin(inst328_cout), .A(inst312_s), .D(inst309_dout), .K(inst326_kout), .Cout(inst325_cout),
    .S(inst325_s), .Dout(inst325_dout), .Kout(inst325_kout));
  Div_cell inst342 (
    .Cin(inst341_cout), .A(inst325_s), .D(inst326_dout), .K(inst339_kout), .Cout(inst342_cout),
    .S(inst342_s), .Dout(inst342_dout), .Kout(inst342_kout));
  Div_cell inst355 (
    .Cin(inst358_cout), .A(inst342_s), .D(inst339_dout), .K(inst356_kout), .Cout(inst355_cout),
    .S(inst355_s), .Dout(inst355_dout), .Kout(inst355_kout));
  Div_cell inst372 (
    .Cin(inst371_cout), .A(inst355_s), .D(inst356_dout), .K(inst369_kout), .Cout(inst372_cout),
    .S(inst372_s), .Dout(inst372_dout), .Kout(inst372_kout));
  Div_cell inst385 (
    .Cin(inst388_cout), .A(inst372_s), .D(inst369_dout), .K(inst386_kout), .Cout(inst385_cout),
    .S(inst385_s), .Dout(inst385_dout), .Kout(inst385_kout));
  Div_cell inst402 (
    .Cin(inst401_cout), .A(inst385_s), .D(inst386_dout), .K(inst399_kout), .Cout(inst402_cout),
    .S(inst402_s), .Dout(inst402_dout), .Kout(inst402_kout));
  Div_cell inst415 (
    .Cin(inst418_cout), .A(inst402_s), .D(inst399_dout), .K(inst416_kout), .Cout(inst415_cout),
    .S(inst415_s), .Dout(inst415_dout), .Kout(inst415_kout));
  Div_cell inst432 (
    .Cin(inst431_cout), .A(inst415_s), .D(inst416_dout), .K(O[5]), .Cout(O[4]), .Dout(inst432_dout),
    .Kout(inst432_kout));  // open: S
  Div_cell inst13 (
    .Cin(inst12_cout), .A(1'b0), .D(B[4]), .K(inst10_kout), .Cout(inst13_cout), .S(inst13_s),
    .Dout(inst13_dout), .Kout(inst13_kout));
  Div_cell inst26 (
    .Cin(inst29_cout), .A(inst13_s), .D(inst10_dout), .K(inst27_kout), .Cout(inst26_cout), .S(inst26_s),
    .Dout(inst26_dout), .Kout(inst26_kout));
  Div_cell inst43 (
    .Cin(inst42_cout), .A(inst26_s), .D(inst27_dout), .K(inst40_kout), .Cout(inst43_cout), .S(inst43_s),
    .Dout(inst43_dout), .Kout(inst43_kout));
  Div_cell inst311 (
    .Cin(inst314_cout), .A(inst43_s), .D(inst40_dout), .K(inst312_kout), .Cout(inst311_cout), .S(inst311_s),
    .Dout(inst311_dout), .Kout(inst311_kout));
  Div_cell inst328 (
    .Cin(inst327_cout), .A(inst311_s), .D(inst312_dout), .K(inst325_kout), .Cout(inst328_cout),
    .S(inst328_s), .Dout(inst328_dout), .Kout(inst328_kout));
  Div_cell inst341 (
    .Cin(inst344_cout), .A(inst328_s), .D(inst325_dout), .K(inst342_kout), .Cout(inst341_cout),
    .S(inst341_s), .Dout(inst341_dout), .Kout(inst341_kout));
  Div_cell inst358 (
    .Cin(inst357_cout), .A(inst341_s), .D(inst342_dout), .K(inst355_kout), .Cout(inst358_cout),
    .S(inst358_s), .Dout(inst358_dout), .Kout(inst358_kout));
  Div_cell inst371 (
    .Cin(inst374_cout), .A(inst358_s), .D(inst355_dout), .K(inst372_kout), .Cout(inst371_cout),
    .S(inst371_s), .Dout(inst371_dout), .Kout(inst371_kout));
  Div_cell inst388 (
    .Cin(inst387_cout), .A(inst371_s), .D(inst372_dout), .K(inst385_kout), .Cout(inst388_cout),
    .S(inst388_s), .Dout(inst388_dout), .Kout(inst388_kout));
  Div_cell inst401 (
    .Cin(inst404_cout), .A(inst388_s), .D(inst385_dout), .K(inst402_kout), .Cout(inst401_cout),
    .S(inst401_s), .Dout(inst401_dout), .Kout(inst401_kout));
  Div_cell inst418 (
    .Cin(inst417_cout), .A(inst401_s), .D(inst402_dout), .K(inst415_kout), .Cout(inst418_cout),
    .S(inst418_s), .Dout(inst418_dout), .Kout(inst418_kout));
  Div_cell inst431 (
    .Cin(inst434_cout), .A(inst418_s), .D(inst415_dout), .K(inst432_kout), .Cout(inst431_cout),
    .S(inst431_s), .Dout(inst431_dout), .Kout(inst431_kout));
  Div_cell inst448 (
    .Cin(inst447_cout), .A(inst431_s), .D(inst432_dout), .K(O[4]), .Cout(O[3]), .Dout(inst448_dout),
    .Kout(inst448_kout));  // open: S
  Div_cell inst12 (
    .Cin(inst15_cout), .A(1'b0), .D(B[3]), .K(inst13_kout), .Cout(inst12_cout), .S(inst12_s),
    .Dout(inst12_dout), .Kout(inst12_kout));
  Div_cell inst29 (
    .Cin(inst28_cout), .A(inst12_s), .D(inst13_dout), .K(inst26_kout), .Cout(inst29_cout), .S(inst29_s),
    .Dout(inst29_dout), .Kout(inst29_kout));
  Div_cell inst42 (
    .Cin(inst45_cout), .A(inst29_s), .D(inst26_dout), .K(inst43_kout), .Cout(inst42_cout), .S(inst42_s),
    .Dout(inst42_dout), .Kout(inst42_kout));
  Div_cell inst314 (
    .Cin(inst313_cout), .A(inst42_s), .D(inst43_dout), .K(inst311_kout), .Cout(inst314_cout), .S(inst314_s),
    .Dout(inst314_dout), .Kout(inst314_kout));
  Div_cell inst327 (
    .Cin(inst330_cout), .A(inst314_s), .D(inst311_dout), .K(inst328_kout), .Cout(inst327_cout),
    .S(inst327_s), .Dout(inst327_dout), .Kout(inst327_kout));
  Div_cell inst344 (
    .Cin(inst343_cout), .A(inst327_s), .D(inst328_dout), .K(inst341_kout), .Cout(inst344_cout),
    .S(inst344_s), .Dout(inst344_dout), .Kout(inst344_kout));
  Div_cell inst357 (
    .Cin(inst360_cout), .A(inst344_s), .D(inst341_dout), .K(inst358_kout), .Cout(inst357_cout),
    .S(inst357_s), .Dout(inst357_dout), .Kout(inst357_kout));
  Div_cell inst374 (
    .Cin(inst373_cout), .A(inst357_s), .D(inst358_dout), .K(inst371_kout), .Cout(inst374_cout),
    .S(inst374_s), .Dout(inst374_dout), .Kout(inst374_kout));
  Div_cell inst387 (
    .Cin(inst390_cout), .A(inst374_s), .D(inst371_dout), .K(inst388_kout), .Cout(inst387_cout),
    .S(inst387_s), .Dout(inst387_dout), .Kout(inst387_kout));
  Div_cell inst404 (
    .Cin(inst403_cout), .A(inst387_s), .D(inst388_dout), .K(inst401_kout), .Cout(inst404_cout),
    .S(inst404_s), .Dout(inst404_dout), .Kout(inst404_kout));
  Div_cell inst417 (
    .Cin(inst420_cout), .A(inst404_s), .D(inst401_dout), .K(inst418_kout), .Cout(inst417_cout),
    .S(inst417_s), .Dout(inst417_dout), .Kout(inst417_kout));
  Div_cell inst434 (
    .Cin(inst433_cout), .A(inst417_s), .D(inst418_dout), .K(inst431_kout), .Cout(inst434_cout),
    .S(inst434_s), .Dout(inst434_dout), .Kout(inst434_kout));
  Div_cell inst447 (
    .Cin(inst450_cout), .A(inst434_s), .D(inst431_dout), .K(inst448_kout), .Cout(inst447_cout),
    .S(inst447_s), .Dout(inst447_dout), .Kout(inst447_kout));
  Div_cell inst464 (
    .Cin(inst463_cout), .A(inst447_s), .D(inst448_dout), .K(O[3]), .Cout(O[2]), .Dout(inst464_dout),
    .Kout(inst464_kout));  // open: S
  Div_cell inst15 (
    .Cin(inst14_cout), .A(1'b0), .D(B[2]), .K(inst12_kout), .Cout(inst15_cout), .S(inst15_s),
    .Dout(inst15_dout), .Kout(inst15_kout));
  Div_cell inst28 (
    .Cin(inst31_cout), .A(inst15_s), .D(inst12_dout), .K(inst29_kout), .Cout(inst28_cout), .S(inst28_s),
    .Dout(inst28_dout), .Kout(inst28_kout));
  Div_cell inst45 (
    .Cin(inst44_cout), .A(inst28_s), .D(inst29_dout), .K(inst42_kout), .Cout(inst45_cout), .S(inst45_s),
    .Dout(inst45_dout), .Kout(inst45_kout));
  Div_cell inst313 (
    .Cin(inst316_cout), .A(inst45_s), .D(inst42_dout), .K(inst314_kout), .Cout(inst313_cout), .S(inst313_s),
    .Dout(inst313_dout), .Kout(inst313_kout));
  Div_cell inst330 (
    .Cin(inst329_cout), .A(inst313_s), .D(inst314_dout), .K(inst327_kout), .Cout(inst330_cout),
    .S(inst330_s), .Dout(inst330_dout), .Kout(inst330_kout));
  Div_cell inst343 (
    .Cin(inst346_cout), .A(inst330_s), .D(inst327_dout), .K(inst344_kout), .Cout(inst343_cout),
    .S(inst343_s), .Dout(inst343_dout), .Kout(inst343_kout));
  Div_cell inst360 (
    .Cin(inst359_cout), .A(inst343_s), .D(inst344_dout), .K(inst357_kout), .Cout(inst360_cout),
    .S(inst360_s), .Dout(inst360_dout), .Kout(inst360_kout));
  Div_cell inst373 (
    .Cin(inst376_cout), .A(inst360_s), .D(inst357_dout), .K(inst374_kout), .Cout(inst373_cout),
    .S(inst373_s), .Dout(inst373_dout), .Kout(inst373_kout));
  Div_cell inst390 (
    .Cin(inst389_cout), .A(inst373_s), .D(inst374_dout), .K(inst387_kout), .Cout(inst390_cout),
    .S(inst390_s), .Dout(inst390_dout), .Kout(inst390_kout));
  Div_cell inst403 (
    .Cin(inst406_cout), .A(inst390_s), .D(inst387_dout), .K(inst404_kout), .Cout(inst403_cout),
    .S(inst403_s), .Dout(inst403_dout), .Kout(inst403_kout));
  Div_cell inst420 (
    .Cin(inst419_cout), .A(inst403_s), .D(inst404_dout), .K(inst417_kout), .Cout(inst420_cout),
    .S(inst420_s), .Dout(inst420_dout), .Kout(inst420_kout));
  Div_cell inst433 (
    .Cin(inst436_cout), .A(inst420_s), .D(inst417_dout), .K(inst434_kout), .Cout(inst433_cout),
    .S(inst433_s), .Dout(inst433_dout), .Kout(inst433_kout));
  Div_cell inst450 (
    .Cin(inst449_cout), .A(inst433_s), .D(inst434_dout), .K(inst447_kout), .Cout(inst450_cout),
    .S(inst450_s), .Dout(inst450_dout), .Kout(inst450_kout));
  Div_cell inst463 (
    .Cin(inst466_cout), .A(inst450_s), .D(inst447_dout), .K(inst464_kout), .Cout(inst463_cout),
    .S(inst463_s), .Dout(inst463_dout), .Kout(inst463_kout));
  Div_cell inst480 (
    .Cin(inst479_cout), .A(inst463_s), .D(inst464_dout), .K(O[2]), .Cout(O[1]), .Dout(inst480_dout),
    .Kout(inst480_kout));  // open: S
  Div_cell inst14 (
    .Cin(inst48_cout), .A(1'b0), .D(B[1]), .K(inst15_kout), .Cout(inst14_cout), .S(inst14_s),
    .Dout(inst14_dout), .Kout(inst14_kout));
  Div_cell inst31 (
    .Cin(inst30_cout), .A(inst14_s), .D(inst15_dout), .K(inst28_kout), .Cout(inst31_cout), .S(inst31_s),
    .Dout(inst31_dout), .Kout(inst31_kout));
  Div_cell inst44 (
    .Cin(inst47_cout), .A(inst31_s), .D(inst28_dout), .K(inst45_kout), .Cout(inst44_cout), .S(inst44_s),
    .Dout(inst44_dout), .Kout(inst44_kout));
  Div_cell inst316 (
    .Cin(inst315_cout), .A(inst44_s), .D(inst45_dout), .K(inst313_kout), .Cout(inst316_cout), .S(inst316_s),
    .Dout(inst316_dout), .Kout(inst316_kout));
  Div_cell inst329 (
    .Cin(inst332_cout), .A(inst316_s), .D(inst313_dout), .K(inst330_kout), .Cout(inst329_cout),
    .S(inst329_s), .Dout(inst329_dout), .Kout(inst329_kout));
  Div_cell inst346 (
    .Cin(inst345_cout), .A(inst329_s), .D(inst330_dout), .K(inst343_kout), .Cout(inst346_cout),
    .S(inst346_s), .Dout(inst346_dout), .Kout(inst346_kout));
  Div_cell inst359 (
    .Cin(inst362_cout), .A(inst346_s), .D(inst343_dout), .K(inst360_kout), .Cout(inst359_cout),
    .S(inst359_s), .Dout(inst359_dout), .Kout(inst359_kout));
  Div_cell inst376 (
    .Cin(inst375_cout), .A(inst359_s), .D(inst360_dout), .K(inst373_kout), .Cout(inst376_cout),
    .S(inst376_s), .Dout(inst376_dout), .Kout(inst376_kout));
  Div_cell inst389 (
    .Cin(inst392_cout), .A(inst376_s), .D(inst373_dout), .K(inst390_kout), .Cout(inst389_cout),
    .S(inst389_s), .Dout(inst389_dout), .Kout(inst389_kout));
  Div_cell inst406 (
    .Cin(inst405_cout), .A(inst389_s), .D(inst390_dout), .K(inst403_kout), .Cout(inst406_cout),
    .S(inst406_s), .Dout(inst406_dout), .Kout(inst406_kout));
  Div_cell inst419 (
    .Cin(inst422_cout), .A(inst406_s), .D(inst403_dout), .K(inst420_kout), .Cout(inst419_cout),
    .S(inst419_s), .Dout(inst419_dout), .Kout(inst419_kout));
  Div_cell inst436 (
    .Cin(inst435_cout), .A(inst419_s), .D(inst420_dout), .K(inst433_kout), .Cout(inst436_cout),
    .S(inst436_s), .Dout(inst436_dout), .Kout(inst436_kout));
  Div_cell inst449 (
    .Cin(inst452_cout), .A(inst436_s), .D(inst433_dout), .K(inst450_kout), .Cout(inst449_cout),
    .S(inst449_s), .Dout(inst449_dout), .Kout(inst449_kout));
  Div_cell inst466 (
    .Cin(inst465_cout), .A(inst449_s), .D(inst450_dout), .K(inst463_kout), .Cout(inst466_cout),
    .S(inst466_s), .Dout(inst466_dout), .Kout(inst466_kout));
  Div_cell inst479 (
    .Cin(inst482_cout), .A(inst466_s), .D(inst463_dout), .K(inst480_kout), .Cout(inst479_cout),
    .S(inst479_s), .Dout(inst479_dout), .Kout(inst479_kout));
  Div_cell inst496 (
    .Cin(inst495_cout), .A(inst479_s), .D(inst480_dout), .K(O[1]), .Cout(O[0]), .S(inst496_s),
    .Kout(inst496_kout));  // open: Dout
  Div_cell inst48 (
    .Cin(inst48_kout), .A(A[15]), .D(B[0]), .K(inst14_kout), .Cout(inst48_cout), .S(inst48_s),
    .Dout(inst48_dout), .Kout(inst48_kout));
  Div_cell inst30 (
    .Cin(inst49_cout), .A(inst48_s), .D(inst14_dout), .K(inst31_kout), .Cout(inst30_cout), .S(inst30_s),
    .Dout(inst30_dout), .Kout(inst30_kout));
  Div_cell inst47 (
    .Cin(inst46_cout), .A(inst30_s), .D(inst31_dout), .K(inst44_kout), .Cout(inst47_cout), .S(inst47_s),
    .Dout(inst47_dout), .Kout(inst47_kout));
  Div_cell inst315 (
    .Cin(inst318_cout), .A(inst47_s), .D(inst44_dout), .K(inst316_kout), .Cout(inst315_cout), .S(inst315_s),
    .Dout(inst315_dout), .Kout(inst315_kout));
  Div_cell inst332 (
    .Cin(inst331_cout), .A(inst315_s), .D(inst316_dout), .K(inst329_kout), .Cout(inst332_cout),
    .S(inst332_s), .Dout(inst332_dout), .Kout(inst332_kout));
  Div_cell inst345 (
    .Cin(inst348_cout), .A(inst332_s), .D(inst329_dout), .K(inst346_kout), .Cout(inst345_cout),
    .S(inst345_s), .Dout(inst345_dout), .Kout(inst345_kout));
  Div_cell inst362 (
    .Cin(inst361_cout), .A(inst345_s), .D(inst346_dout), .K(inst359_kout), .Cout(inst362_cout),
    .S(inst362_s), .Dout(inst362_dout), .Kout(inst362_kout));
  Div_cell inst375 (
    .Cin(inst378_cout), .A(inst362_s), .D(inst359_dout), .K(inst376_kout), .Cout(inst375_cout),
    .S(inst375_s), .Dout(inst375_dout), .Kout(inst375_kout));
  Div_cell inst392 (
    .Cin(inst391_cout), .A(inst375_s), .D(inst376_dout), .K(inst389_kout), .Cout(inst392_cout),
    .S(inst392_s), .Dout(inst392_dout), .Kout(inst392_kout));
  Div_cell inst405 (
    .Cin(inst408_cout), .A(inst392_s), .D(inst389_dout), .K(inst406_kout), .Cout(inst405_cout),
    .S(inst405_s), .Dout(inst405_dout), .Kout(inst405_kout));
  Div_cell inst422 (
    .Cin(inst421_cout), .A(inst405_s), .D(inst406_dout), .K(inst419_kout), .Cout(inst422_cout),
    .S(inst422_s), .Dout(inst422_dout), .Kout(inst422_kout));
  Div_cell inst435 (
    .Cin(inst438_cout), .A(inst422_s), .D(inst419_dout), .K(inst436_kout), .Cout(inst435_cout),
    .S(inst435_s), .Dout(inst435_dout), .Kout(inst435_kout));
  Div_cell inst452 (
    .Cin(inst451_cout), .A(inst435_s), .D(inst436_dout), .K(inst449_kout), .Cout(inst452_cout),
    .S(inst452_s), .Dout(inst452_dout), .Kout(inst452_kout));
  Div_cell inst465 (
    .Cin(inst468_cout), .A(inst452_s), .D(inst449_dout), .K(inst466_kout), .Cout(inst465_cout),
    .S(inst465_s), .Dout(inst465_dout), .Kout(inst465_kout));
  Div_cell inst482 (
    .Cin(inst481_cout), .A(inst465_s), .D(inst466_dout), .K(inst479_kout), .Cout(inst482_cout),
    .S(inst482_s), .Dout(inst482_dout), .Kout(inst482_kout));
  Div_cell inst495 (
    .Cin(inst498_cout), .A(inst482_s), .D(inst479_dout), .K(inst496_kout), .Cout(inst495_cout),
    .S(inst495_s), .Dout(inst495_dout), .Kout(inst495_kout));
  and inst0001 (inst0001_out, inst496_s, inst495_dout);
  fulladder inst00017 (.A(inst495_s), .B(inst0001_out), .Cin(inst00018_cout));  // open: Sum, Cout
  Div_cell inst49 (
    .Cin(inst49_kout), .A(A[14]), .D(inst48_dout), .K(inst30_kout), .Cout(inst49_cout), .S(inst49_s),
    .Dout(inst49_dout), .Kout(inst49_kout));
  Div_cell inst46 (
    .Cin(inst50_cout), .A(inst49_s), .D(inst30_dout), .K(inst47_kout), .Cout(inst46_cout), .S(inst46_s),
    .Dout(inst46_dout), .Kout(inst46_kout));
  Div_cell inst318 (
    .Cin(inst317_cout), .A(inst46_s), .D(inst47_dout), .K(inst315_kout), .Cout(inst318_cout), .S(inst318_s),
    .Dout(inst318_dout), .Kout(inst318_kout));
  Div_cell inst331 (
    .Cin(inst334_cout), .A(inst318_s), .D(inst315_dout), .K(inst332_kout), .Cout(inst331_cout),
    .S(inst331_s), .Dout(inst331_dout), .Kout(inst331_kout));
  Div_cell inst348 (
    .Cin(inst347_cout), .A(inst331_s), .D(inst332_dout), .K(inst345_kout), .Cout(inst348_cout),
    .S(inst348_s), .Dout(inst348_dout), .Kout(inst348_kout));
  Div_cell inst361 (
    .Cin(inst364_cout), .A(inst348_s), .D(inst345_dout), .K(inst362_kout), .Cout(inst361_cout),
    .S(inst361_s), .Dout(inst361_dout), .Kout(inst361_kout));
  Div_cell inst378 (
    .Cin(inst377_cout), .A(inst361_s), .D(inst362_dout), .K(inst375_kout), .Cout(inst378_cout),
    .S(inst378_s), .Dout(inst378_dout), .Kout(inst378_kout));
  Div_cell inst391 (
    .Cin(inst394_cout), .A(inst378_s), .D(inst375_dout), .K(inst392_kout), .Cout(inst391_cout),
    .S(inst391_s), .Dout(inst391_dout), .Kout(inst391_kout));
  Div_cell inst408 (
    .Cin(inst407_cout), .A(inst391_s), .D(inst392_dout), .K(inst405_kout), .Cout(inst408_cout),
    .S(inst408_s), .Dout(inst408_dout), .Kout(inst408_kout));
  Div_cell inst421 (
    .Cin(inst424_cout), .A(inst408_s), .D(inst405_dout), .K(inst422_kout), .Cout(inst421_cout),
    .S(inst421_s), .Dout(inst421_dout), .Kout(inst421_kout));
  Div_cell inst438 (
    .Cin(inst437_cout), .A(inst421_s), .D(inst422_dout), .K(inst435_kout), .Cout(inst438_cout),
    .S(inst438_s), .Dout(inst438_dout), .Kout(inst438_kout));
  Div_cell inst451 (
    .Cin(inst454_cout), .A(inst438_s), .D(inst435_dout), .K(inst452_kout), .Cout(inst451_cout),
    .S(inst451_s), .Dout(inst451_dout), .Kout(inst451_kout));
  Div_cell inst468 (
    .Cin(inst467_cout), .A(inst451_s), .D(inst452_dout), .K(inst465_kout), .Cout(inst468_cout),
    .S(inst468_s), .Dout(inst468_dout), .Kout(inst468_kout));
  Div_cell inst481 (
    .Cin(inst484_cout), .A(inst468_s), .D(inst465_dout), .K(inst482_kout), .Cout(inst481_cout),
    .S(inst481_s), .Dout(inst481_dout), .Kout(inst481_kout));
  Div_cell inst498 (
    .Cin(inst497_cout), .A(inst481_s), .D(inst482_dout), .K(inst495_kout), .Cout(inst498_cout),
    .S(inst498_s), .Dout(inst498_dout), .Kout(inst498_kout));
  and inst0002 (inst0002_out, inst496_s, inst498_dout);
  fulladder inst00018 (.A(inst498_s), .B(inst0002_out), .Cin(inst00019_cout), .Cout(inst00018_cout));  // open: Sum
  Div_cell inst50 (
    .Cin(inst50_kout), .A(A[13]), .D(inst49_dout), .K(inst46_kout), .Cout(inst50_cout), .S(inst50_s),
    .Dout(inst50_dout), .Kout(inst50_kout));
  Div_cell inst317 (
    .Cin(inst511_cout), .A(inst50_s), .D(inst46_dout), .K(inst318_kout), .Cout(inst317_cout), .S(inst317_s),
    .Dout(inst317_dout), .Kout(inst317_kout));
  Div_cell inst334 (
    .Cin(inst333_cout), .A(inst317_s), .D(inst318_dout), .K(inst331_kout), .Cout(inst334_cout),
    .S(inst334_s), .Dout(inst334_dout), .Kout(inst334_kout));
  Div_cell inst347 (
    .Cin(inst350_cout), .A(inst334_s), .D(inst331_dout), .K(inst348_kout), .Cout(inst347_cout),
    .S(inst347_s), .Dout(inst347_dout), .Kout(inst347_kout));
  Div_cell inst364 (
    .Cin(inst363_cout), .A(inst347_s), .D(inst348_dout), .K(inst361_kout), .Cout(inst364_cout),
    .S(inst364_s), .Dout(inst364_dout), .Kout(inst364_kout));
  Div_cell inst377 (
    .Cin(inst380_cout), .A(inst364_s), .D(inst361_dout), .K(inst378_kout), .Cout(inst377_cout),
    .S(inst377_s), .Dout(inst377_dout), .Kout(inst377_kout));
  Div_cell inst394 (
    .Cin(inst393_cout), .A(inst377_s), .D(inst378_dout), .K(inst391_kout), .Cout(inst394_cout),
    .S(inst394_s), .Dout(inst394_dout), .Kout(inst394_kout));
  Div_cell inst407 (
    .Cin(inst410_cout), .A(inst394_s), .D(inst391_dout), .K(inst408_kout), .Cout(inst407_cout),
    .S(inst407_s), .Dout(inst407_dout), .Kout(inst407_kout));
  Div_cell inst424 (
    .Cin(inst423_cout), .A(inst407_s), .D(inst408_dout), .K(inst421_kout), .Cout(inst424_cout),
    .S(inst424_s), .Dout(inst424_dout), .Kout(inst424_kout));
  Div_cell inst437 (
    .Cin(inst440_cout), .A(inst424_s), .D(inst421_dout), .K(inst438_kout), .Cout(inst437_cout),
    .S(inst437_s), .Dout(inst437_dout), .Kout(inst437_kout));
  Div_cell inst454 (
    .Cin(inst453_cout), .A(inst437_s), .D(inst438_dout), .K(inst451_kout), .Cout(inst454_cout),
    .S(inst454_s), .Dout(inst454_dout), .Kout(inst454_kout));
  Div_cell inst467 (
    .Cin(inst470_cout), .A(inst454_s), .D(inst451_dout), .K(inst468_kout), .Cout(inst467_cout),
    .S(inst467_s), .Dout(inst467_dout), .Kout(inst467_kout));
  Div_cell inst484 (
    .Cin(inst483_cout), .A(inst467_s), .D(inst468_dout), .K(inst481_kout), .Cout(inst484_cout),
    .S(inst484_s), .Dout(inst484_dout), .Kout(inst484_kout));
  Div_cell inst497 (
    .Cin(inst500_cout), .A(inst484_s), .D(inst481_dout), .K(inst498_kout), .Cout(inst497_cout),
    .S(inst497_s), .Dout(inst497_dout), .Kout(inst497_kout));
  fulladder inst00019 (.A(inst0003_out), .B(inst497_s), .Cin(inst00020_cout), .Cout(inst00019_cout));  // open: Sum
  and inst0003 (inst0003_out, inst496_s, inst497_dout);
  Div_cell inst511 (
    .Cin(inst511_kout), .A(A[12]), .D(inst50_dout), .K(inst317_kout), .Cout(inst511_cout), .S(inst511_s),
    .Dout(inst511_dout), .Kout(inst511_kout));
  Div_cell inst333 (
    .Cin(inst512_cout), .A(inst511_s), .D(inst317_dout), .K(inst334_kout), .Cout(inst333_cout),
    .S(inst333_s), .Dout(inst333_dout), .Kout(inst333_kout));
  Div_cell inst350 (
    .Cin(inst349_cout), .A(inst333_s), .D(inst334_dout), .K(inst347_kout), .Cout(inst350_cout),
    .S(inst350_s), .Dout(inst350_dout), .Kout(inst350_kout));
  Div_cell inst363 (
    .Cin(inst366_cout), .A(inst350_s), .D(inst347_dout), .K(inst364_kout), .Cout(inst363_cout),
    .S(inst363_s), .Dout(inst363_dout), .Kout(inst363_kout));
  Div_cell inst380 (
    .Cin(inst379_cout), .A(inst363_s), .D(inst364_dout), .K(inst377_kout), .Cout(inst380_cout),
    .S(inst380_s), .Dout(inst380_dout), .Kout(inst380_kout));
  Div_cell inst393 (
    .Cin(inst396_cout), .A(inst380_s), .D(inst377_dout), .K(inst394_kout), .Cout(inst393_cout),
    .S(inst393_s), .Dout(inst393_dout), .Kout(inst393_kout));
  Div_cell inst410 (
    .Cin(inst409_cout), .A(inst393_s), .D(inst394_dout), .K(inst407_kout), .Cout(inst410_cout),
    .S(inst410_s), .Dout(inst410_dout), .Kout(inst410_kout));
  Div_cell inst423 (
    .Cin(inst426_cout), .A(inst410_s), .D(inst407_dout), .K(inst424_kout), .Cout(inst423_cout),
    .S(inst423_s), .Dout(inst423_dout), .Kout(inst423_kout));
  Div_cell inst440 (
    .Cin(inst439_cout), .A(inst423_s), .D(inst424_dout), .K(inst437_kout), .Cout(inst440_cout),
    .S(inst440_s), .Dout(inst440_dout), .Kout(inst440_kout));
  Div_cell inst453 (
    .Cin(inst456_cout), .A(inst440_s), .D(inst437_dout), .K(inst454_kout), .Cout(inst453_cout),
    .S(inst453_s), .Dout(inst453_dout), .Kout(inst453_kout));
  Div_cell inst470 (
    .Cin(inst469_cout), .A(inst453_s), .D(inst454_dout), .K(inst467_kout), .Cout(inst470_cout),
    .S(inst470_s), .Dout(inst470_dout), .Kout(inst470_kout));
